# EasyEDA Pro project ProDoc_Eprobe_V3_1.epro, schematic 便携式电化学工作站V3_1

## Sheets
1 P1.MCU: Board Name: 便携式电化学工作站V3_1; Create Date: 2024-09-22; Page Name: P1.MCU; Project Name: 便携电化学工作站; Schematic Name: 便携式电化学工作站V3_1; Update Date: 2024-09-23; Company: 嘉立创EDA; Page Size: A4; Version: V1.0
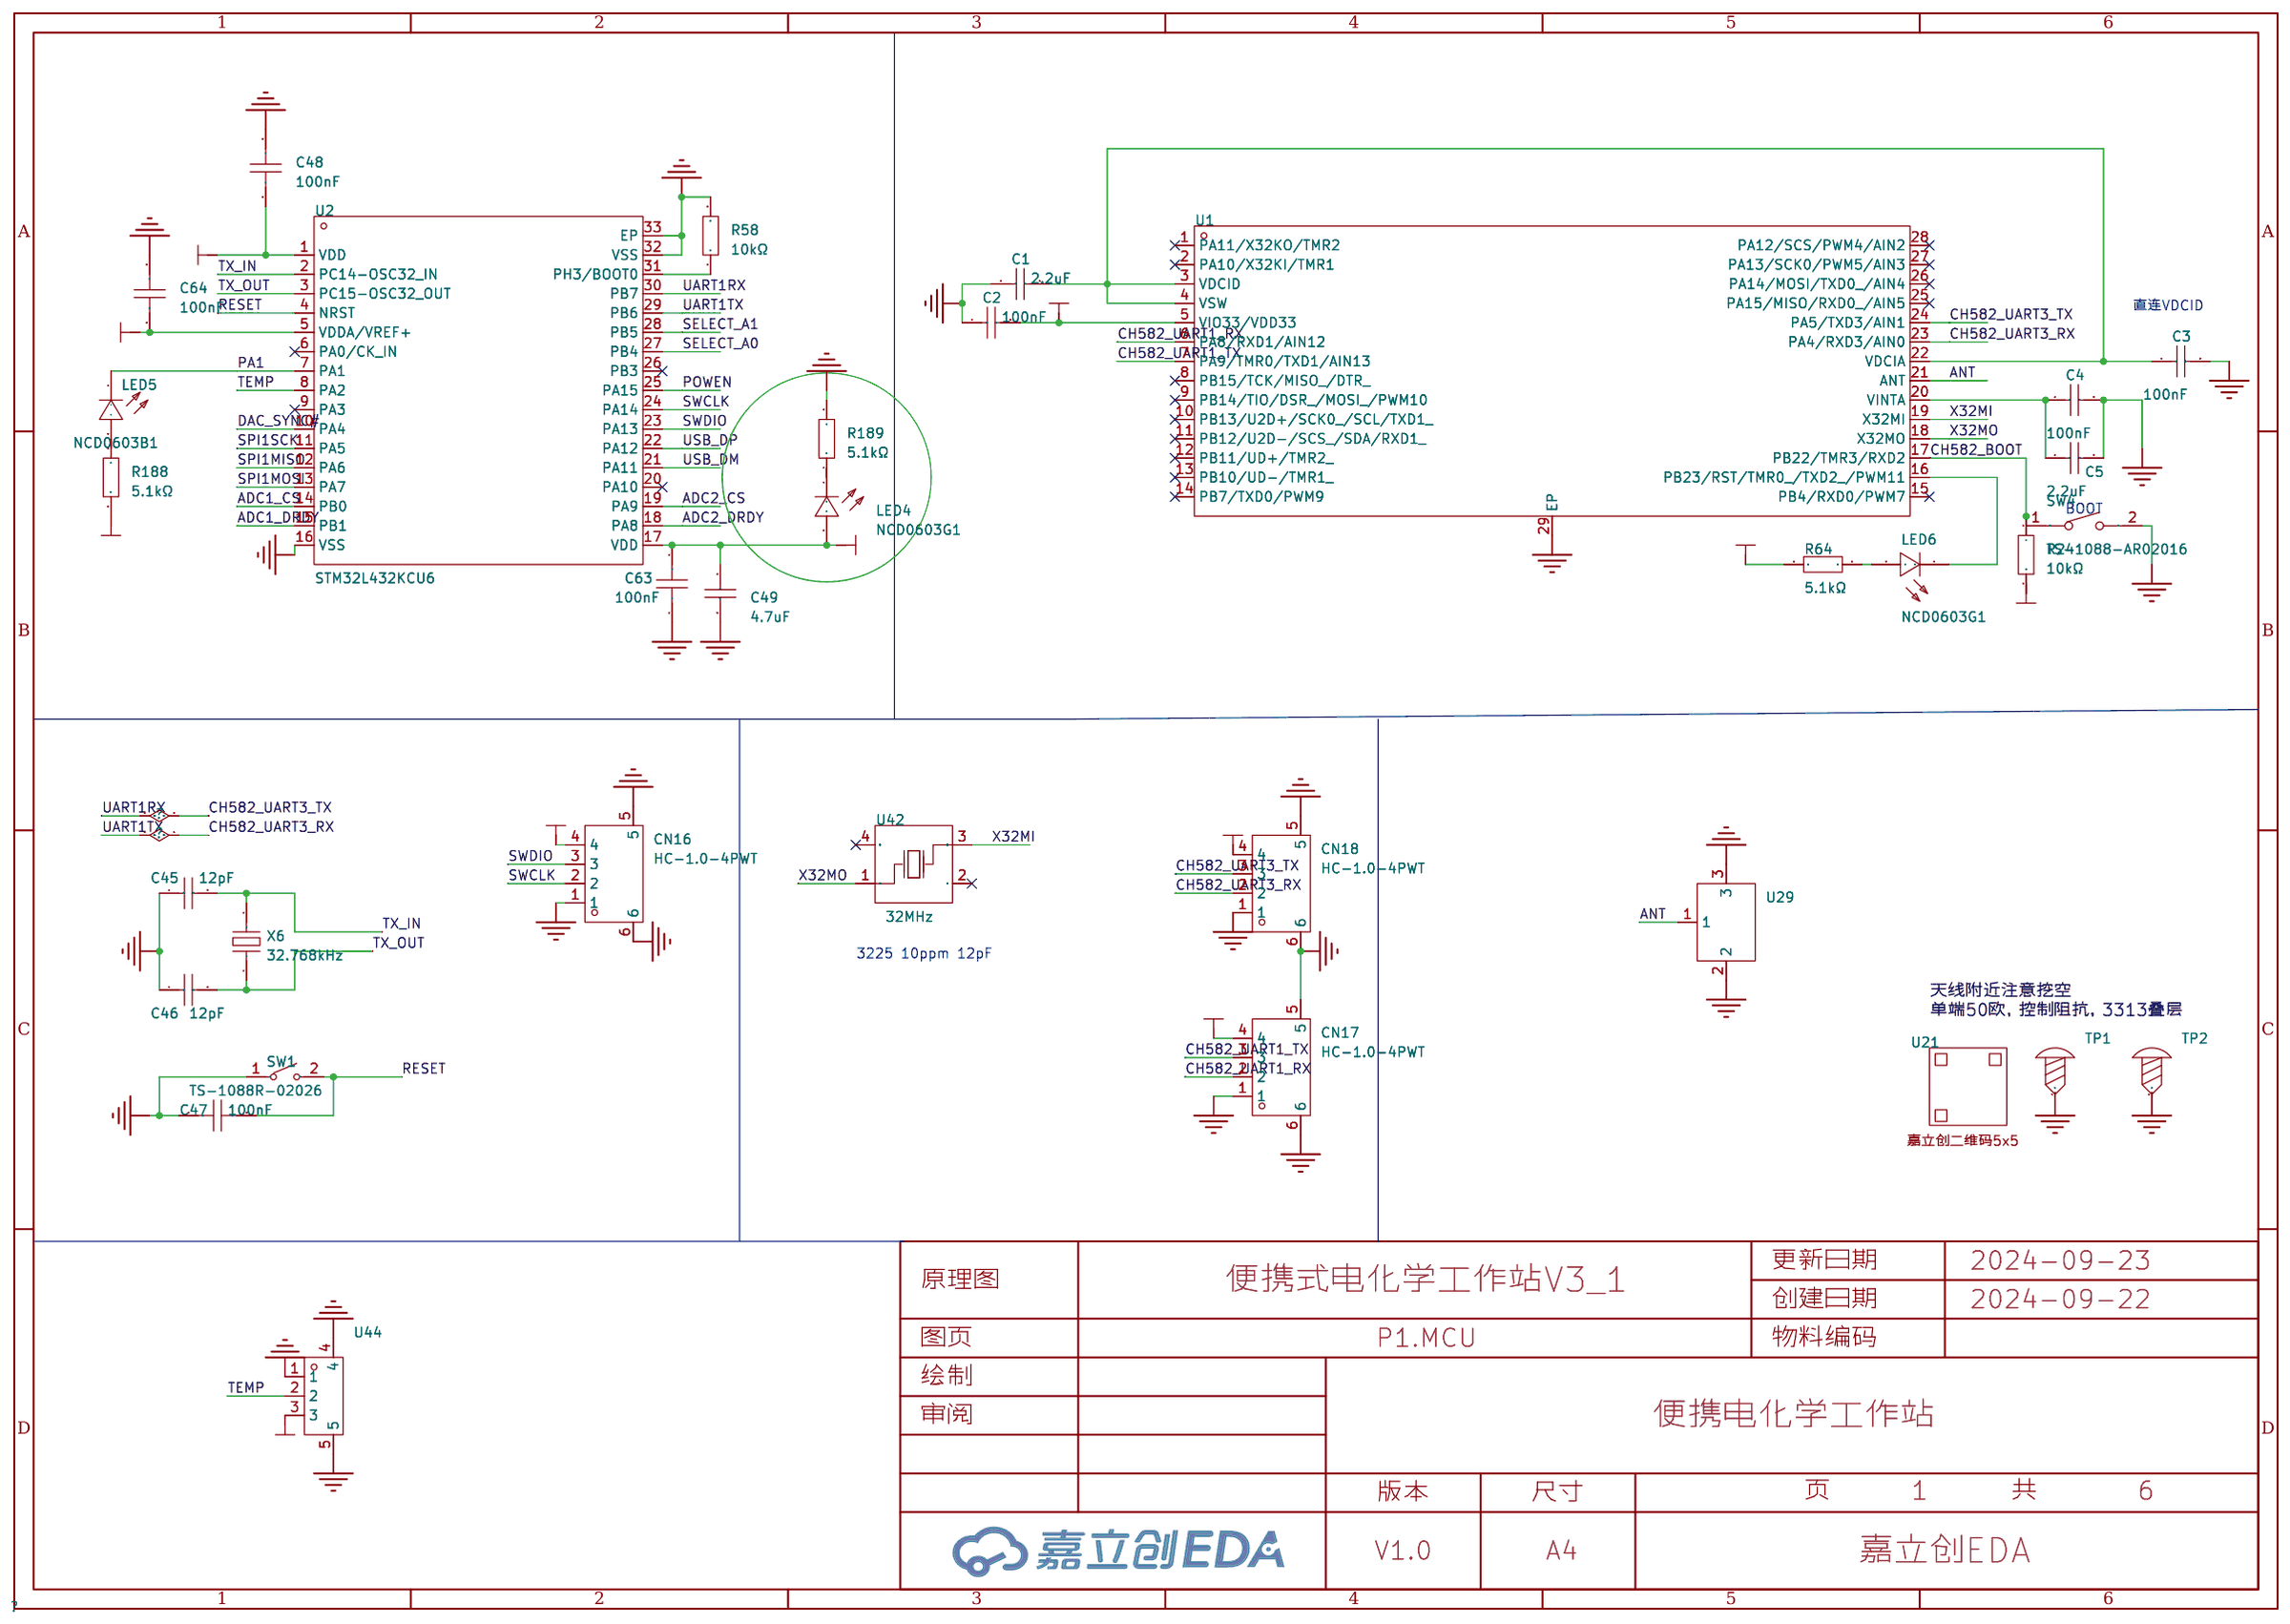
[diagram p0: P1.MCU]
2 P2.Power: Page Name: P2.Power; Update Date: 2024-10-11
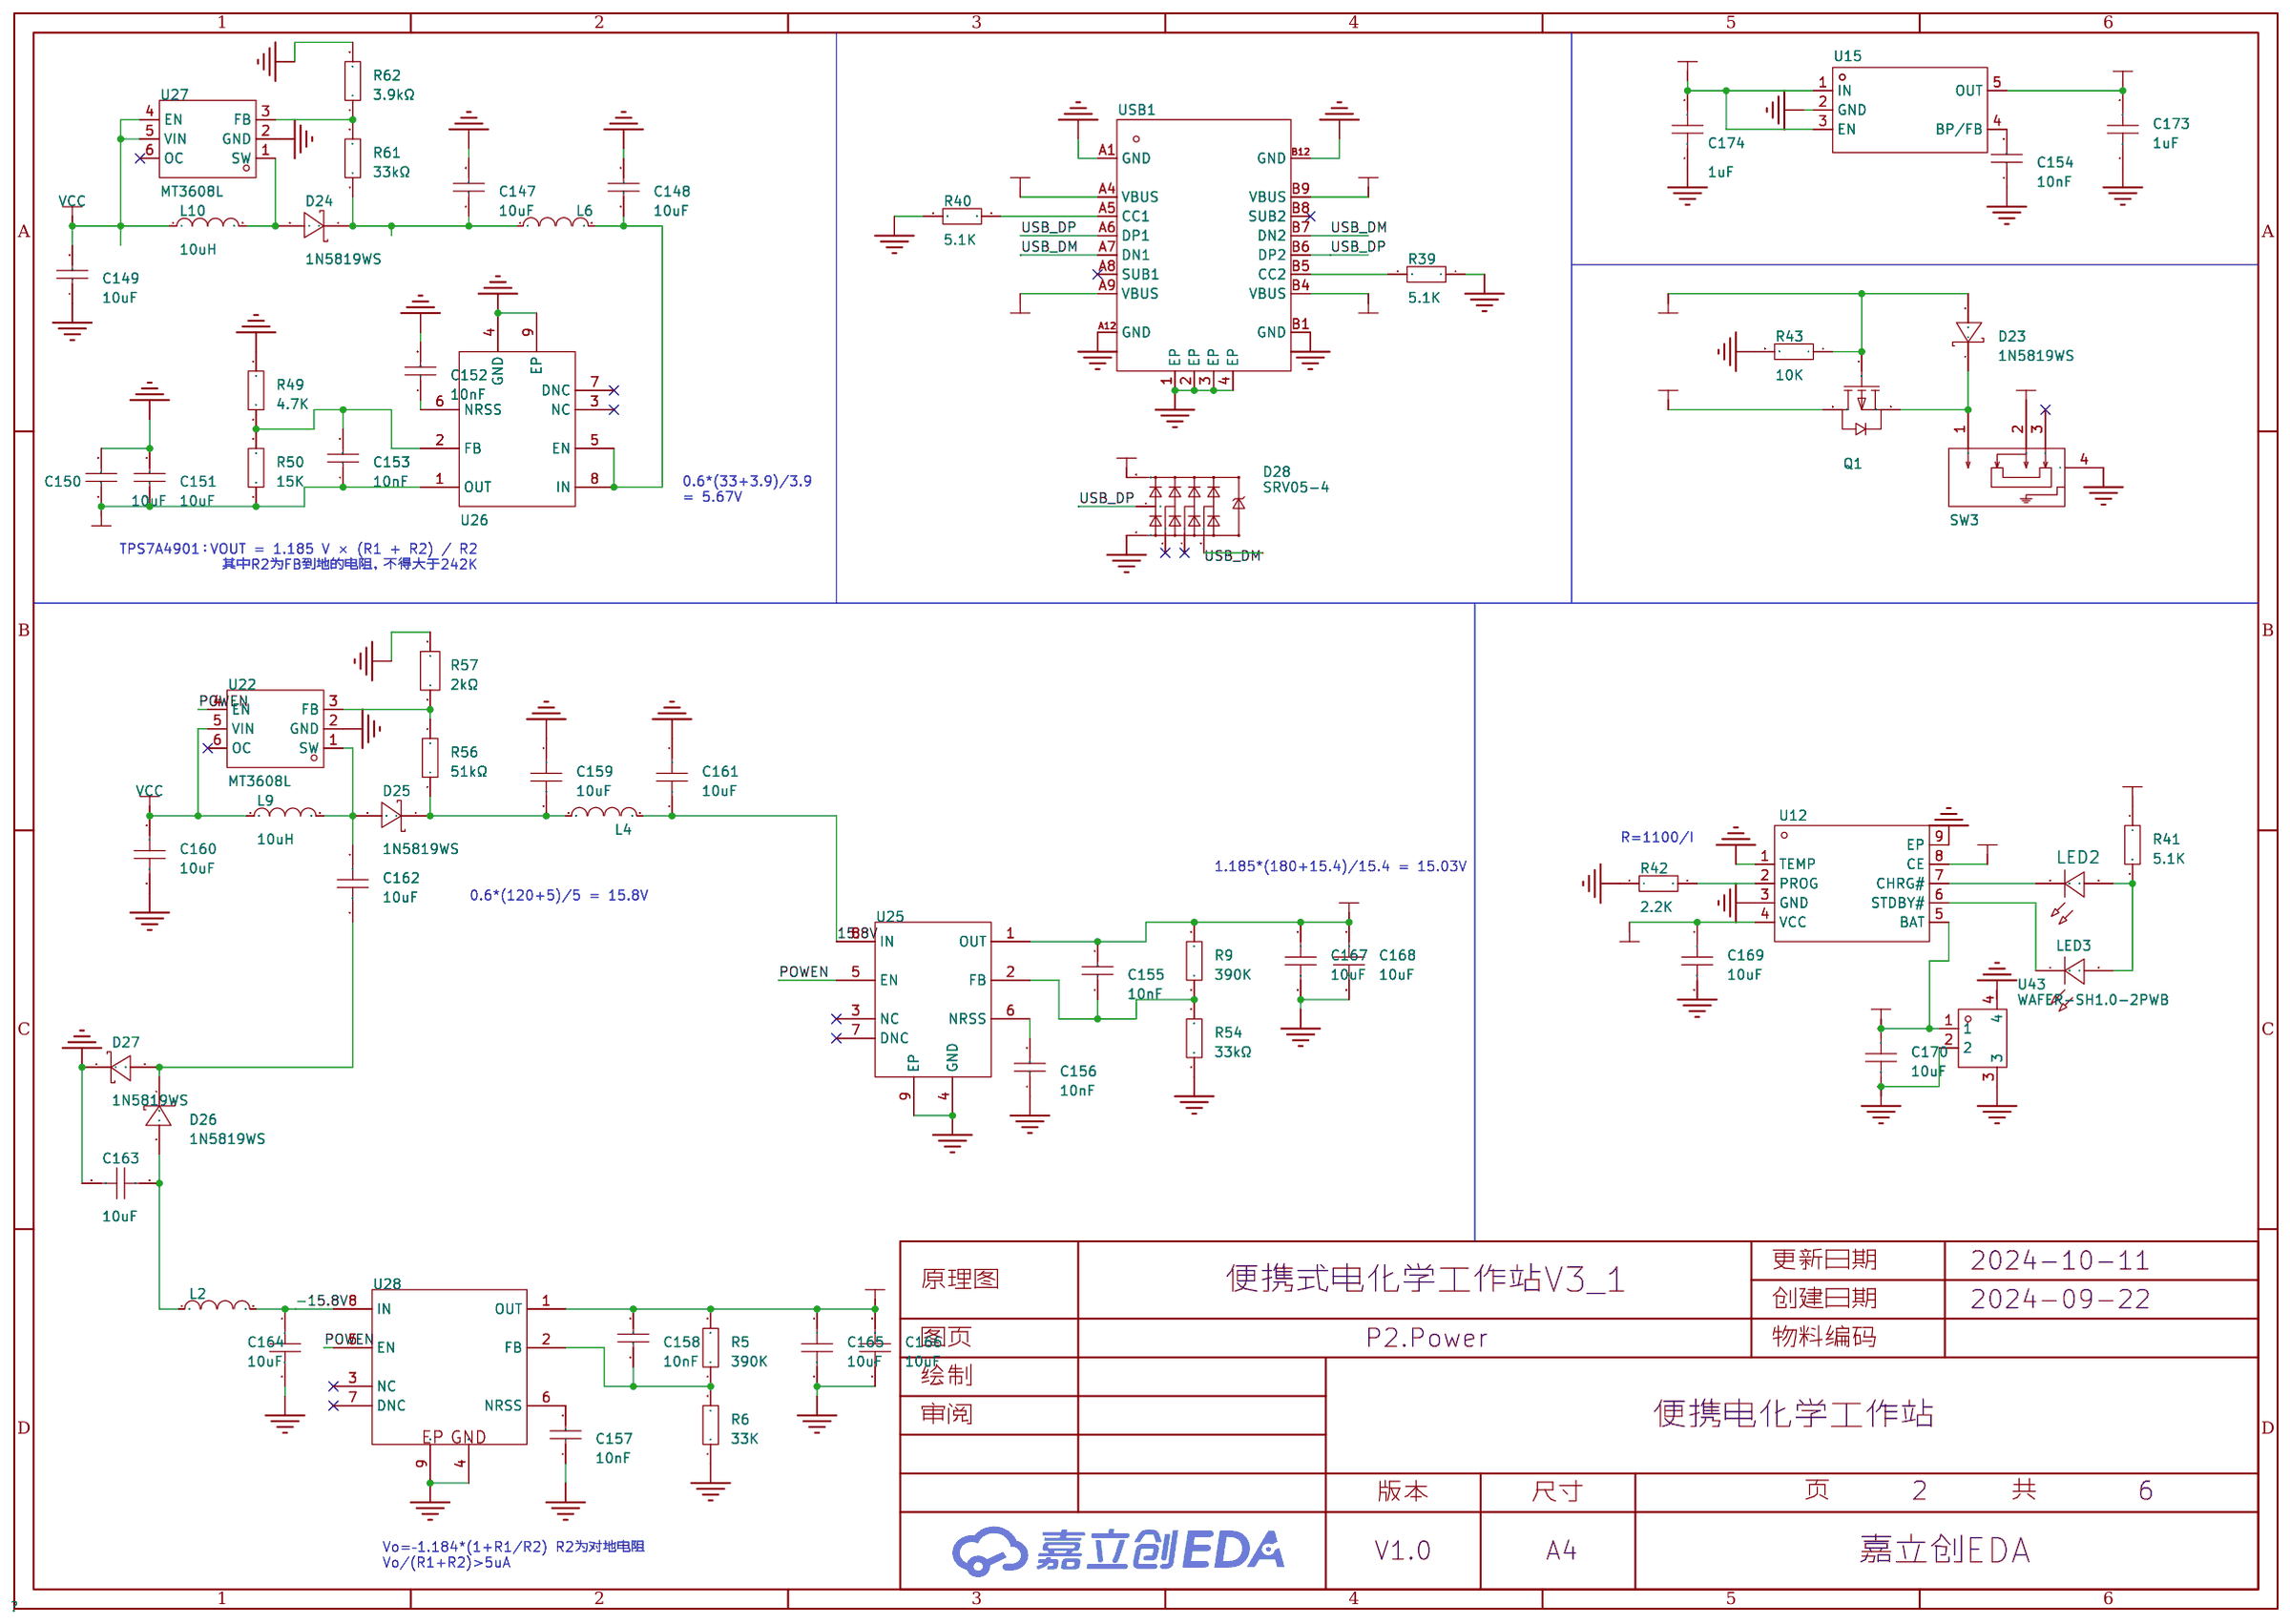
[diagram p1: P2.Power]
3 P3.ADDA: Page Name: P3.ADDA; Update Date: 2024-10-11
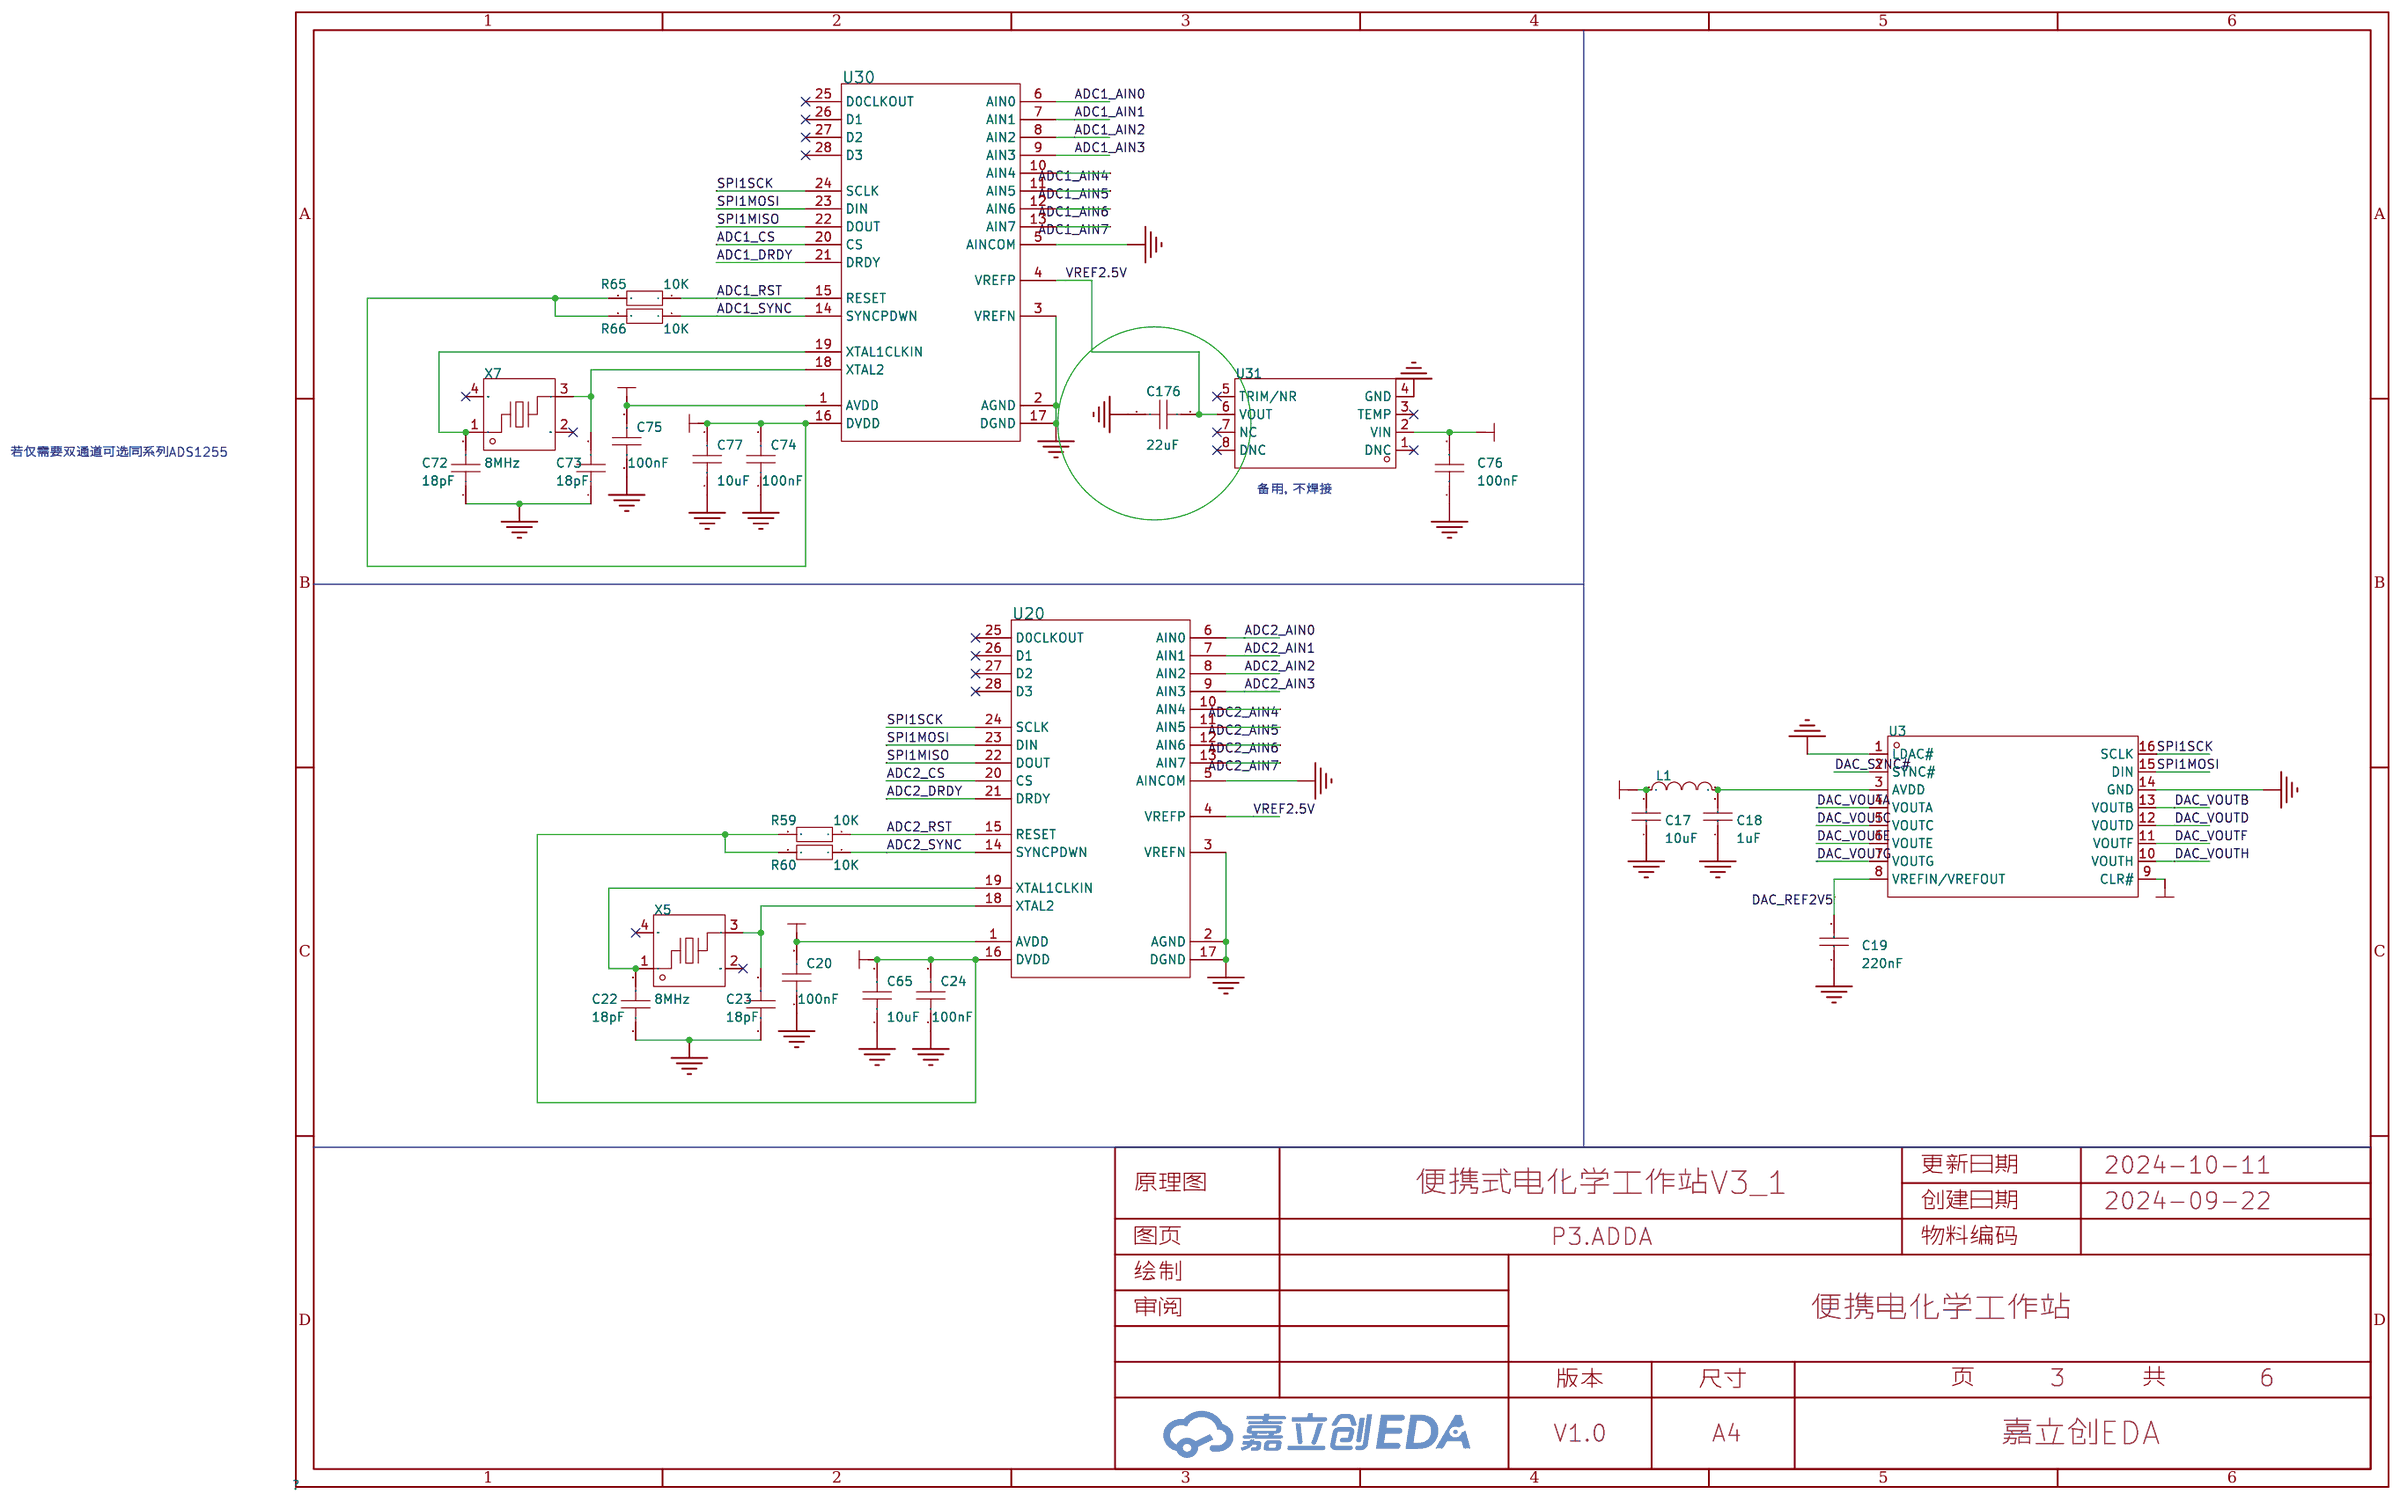
[diagram p2: P3.ADDA]
4 P4.TIA_1: Page Name: P4.TIA_1; Update Date: 2024-10-11
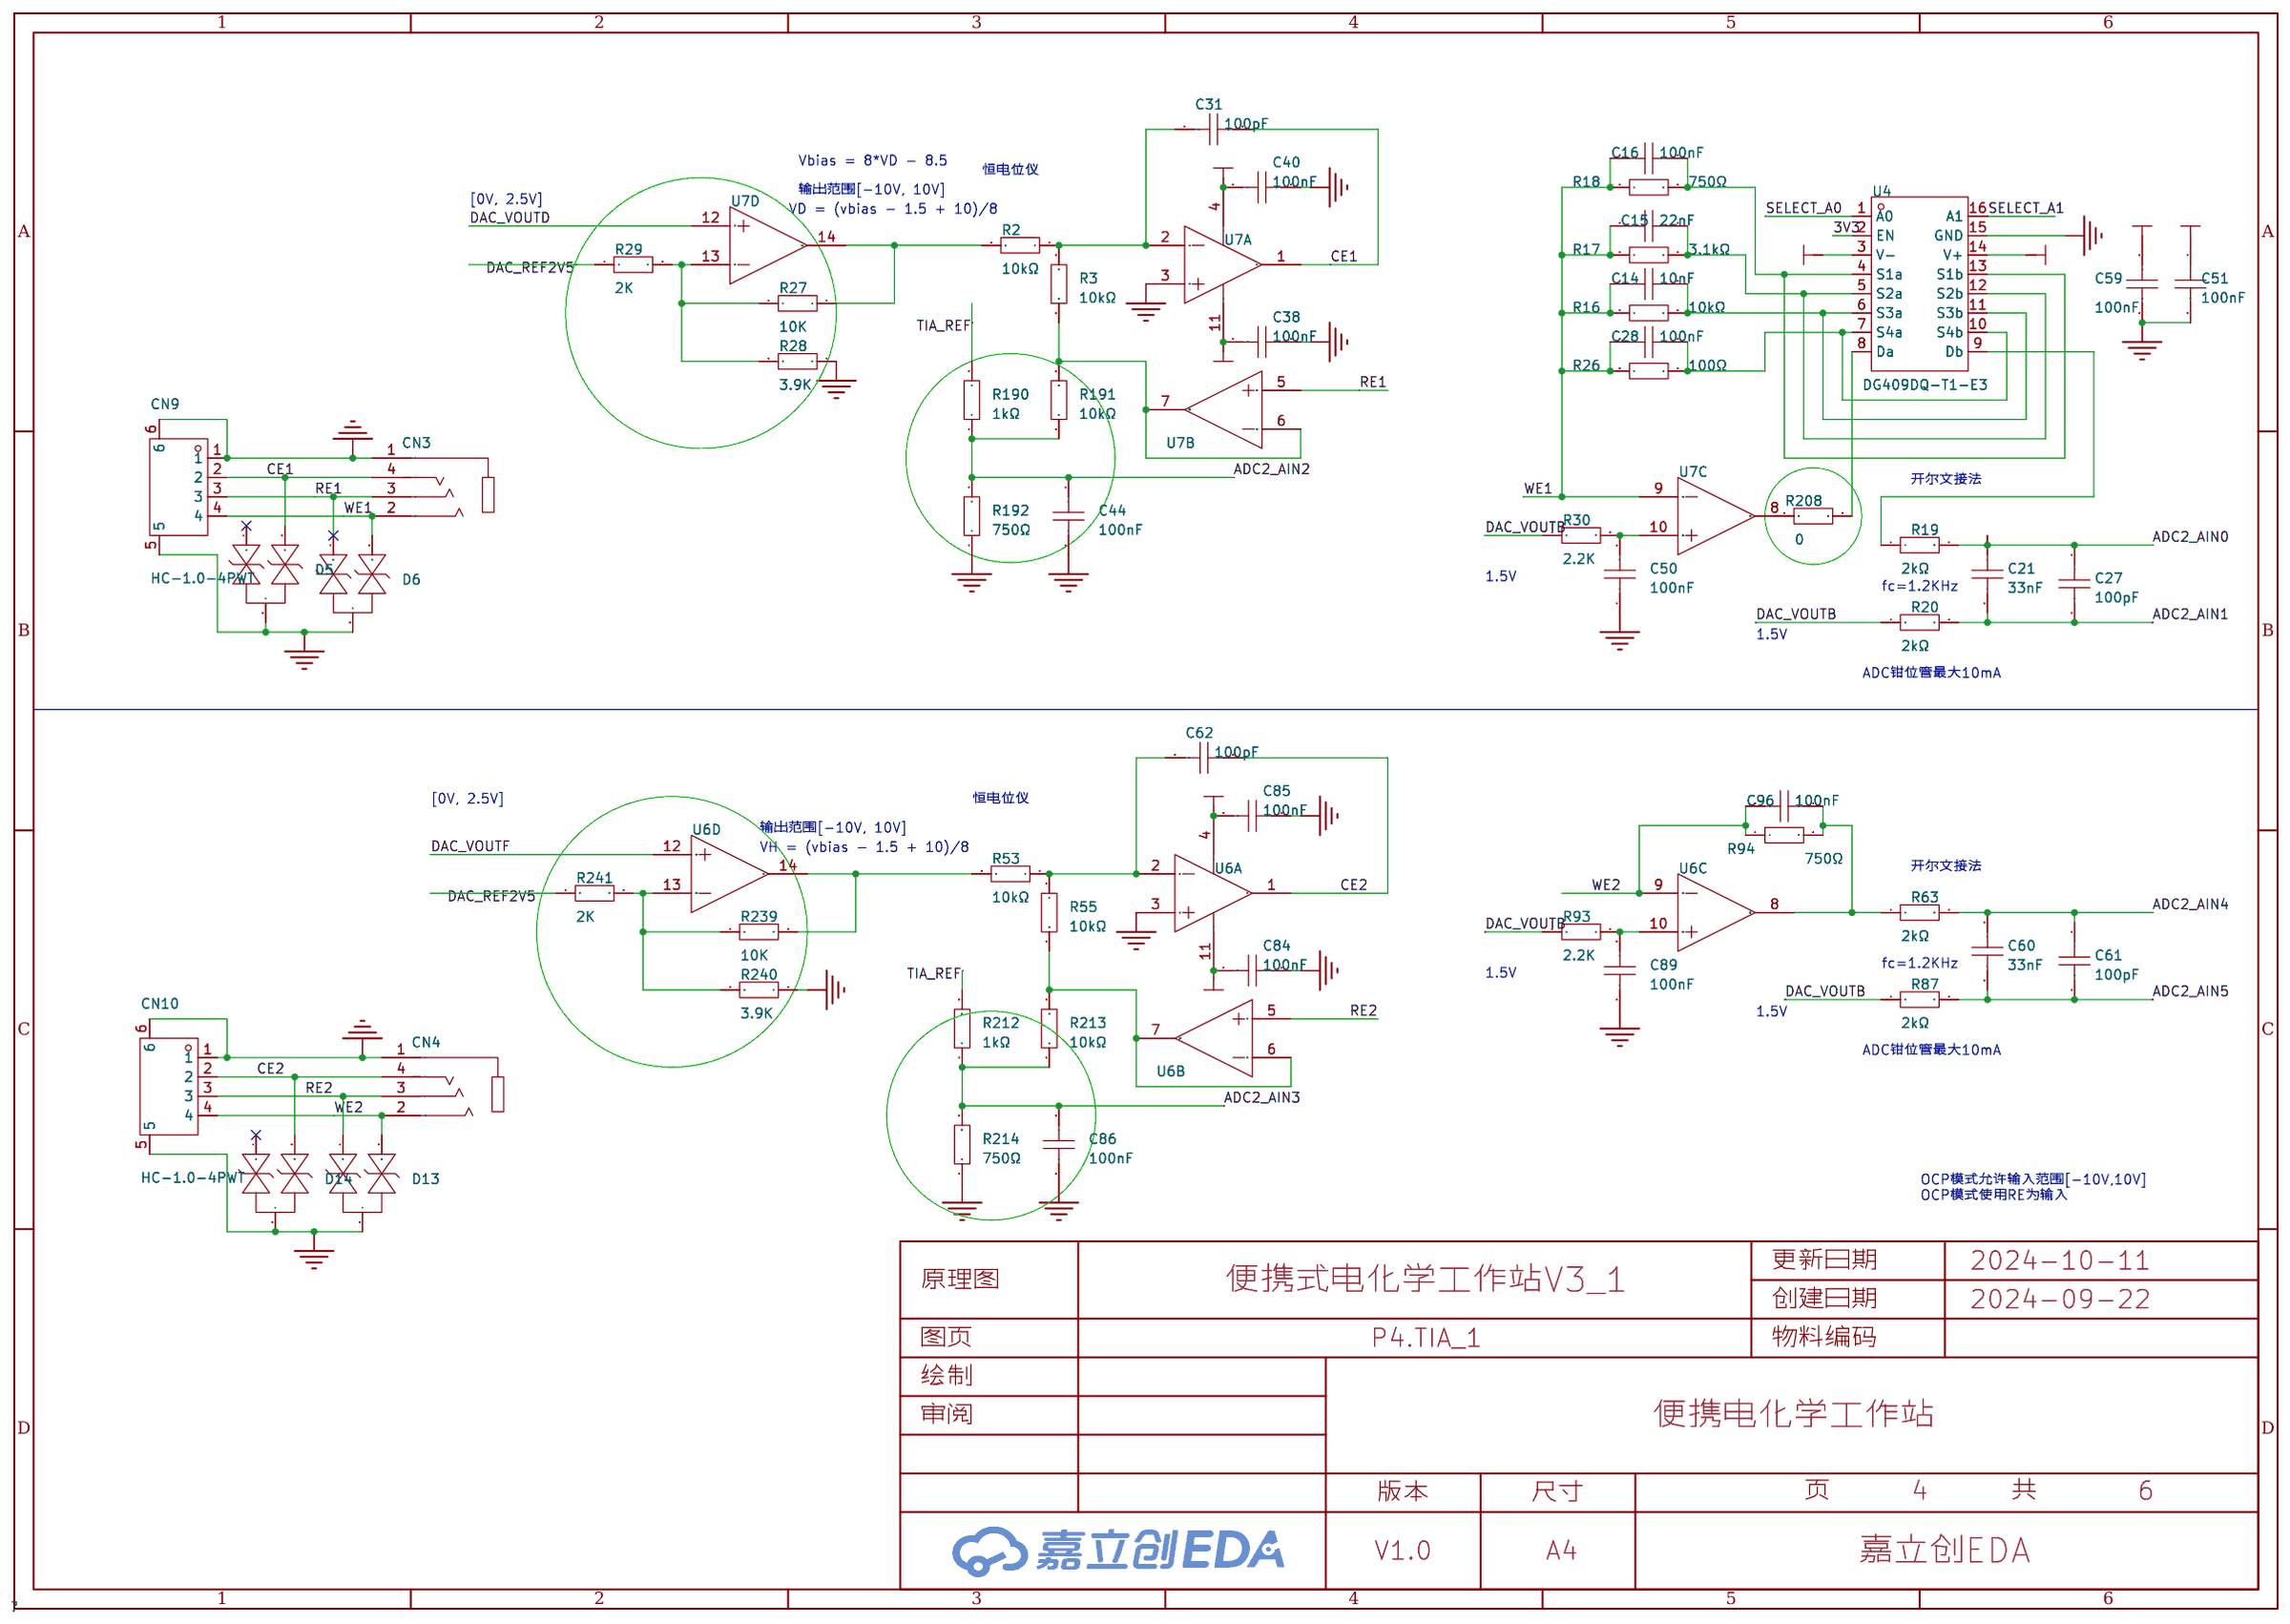
[diagram p3: P4.TIA_1]
5 P4.TIA_2: Page Name: P4.TIA_2; Update Date: 2024-10-11
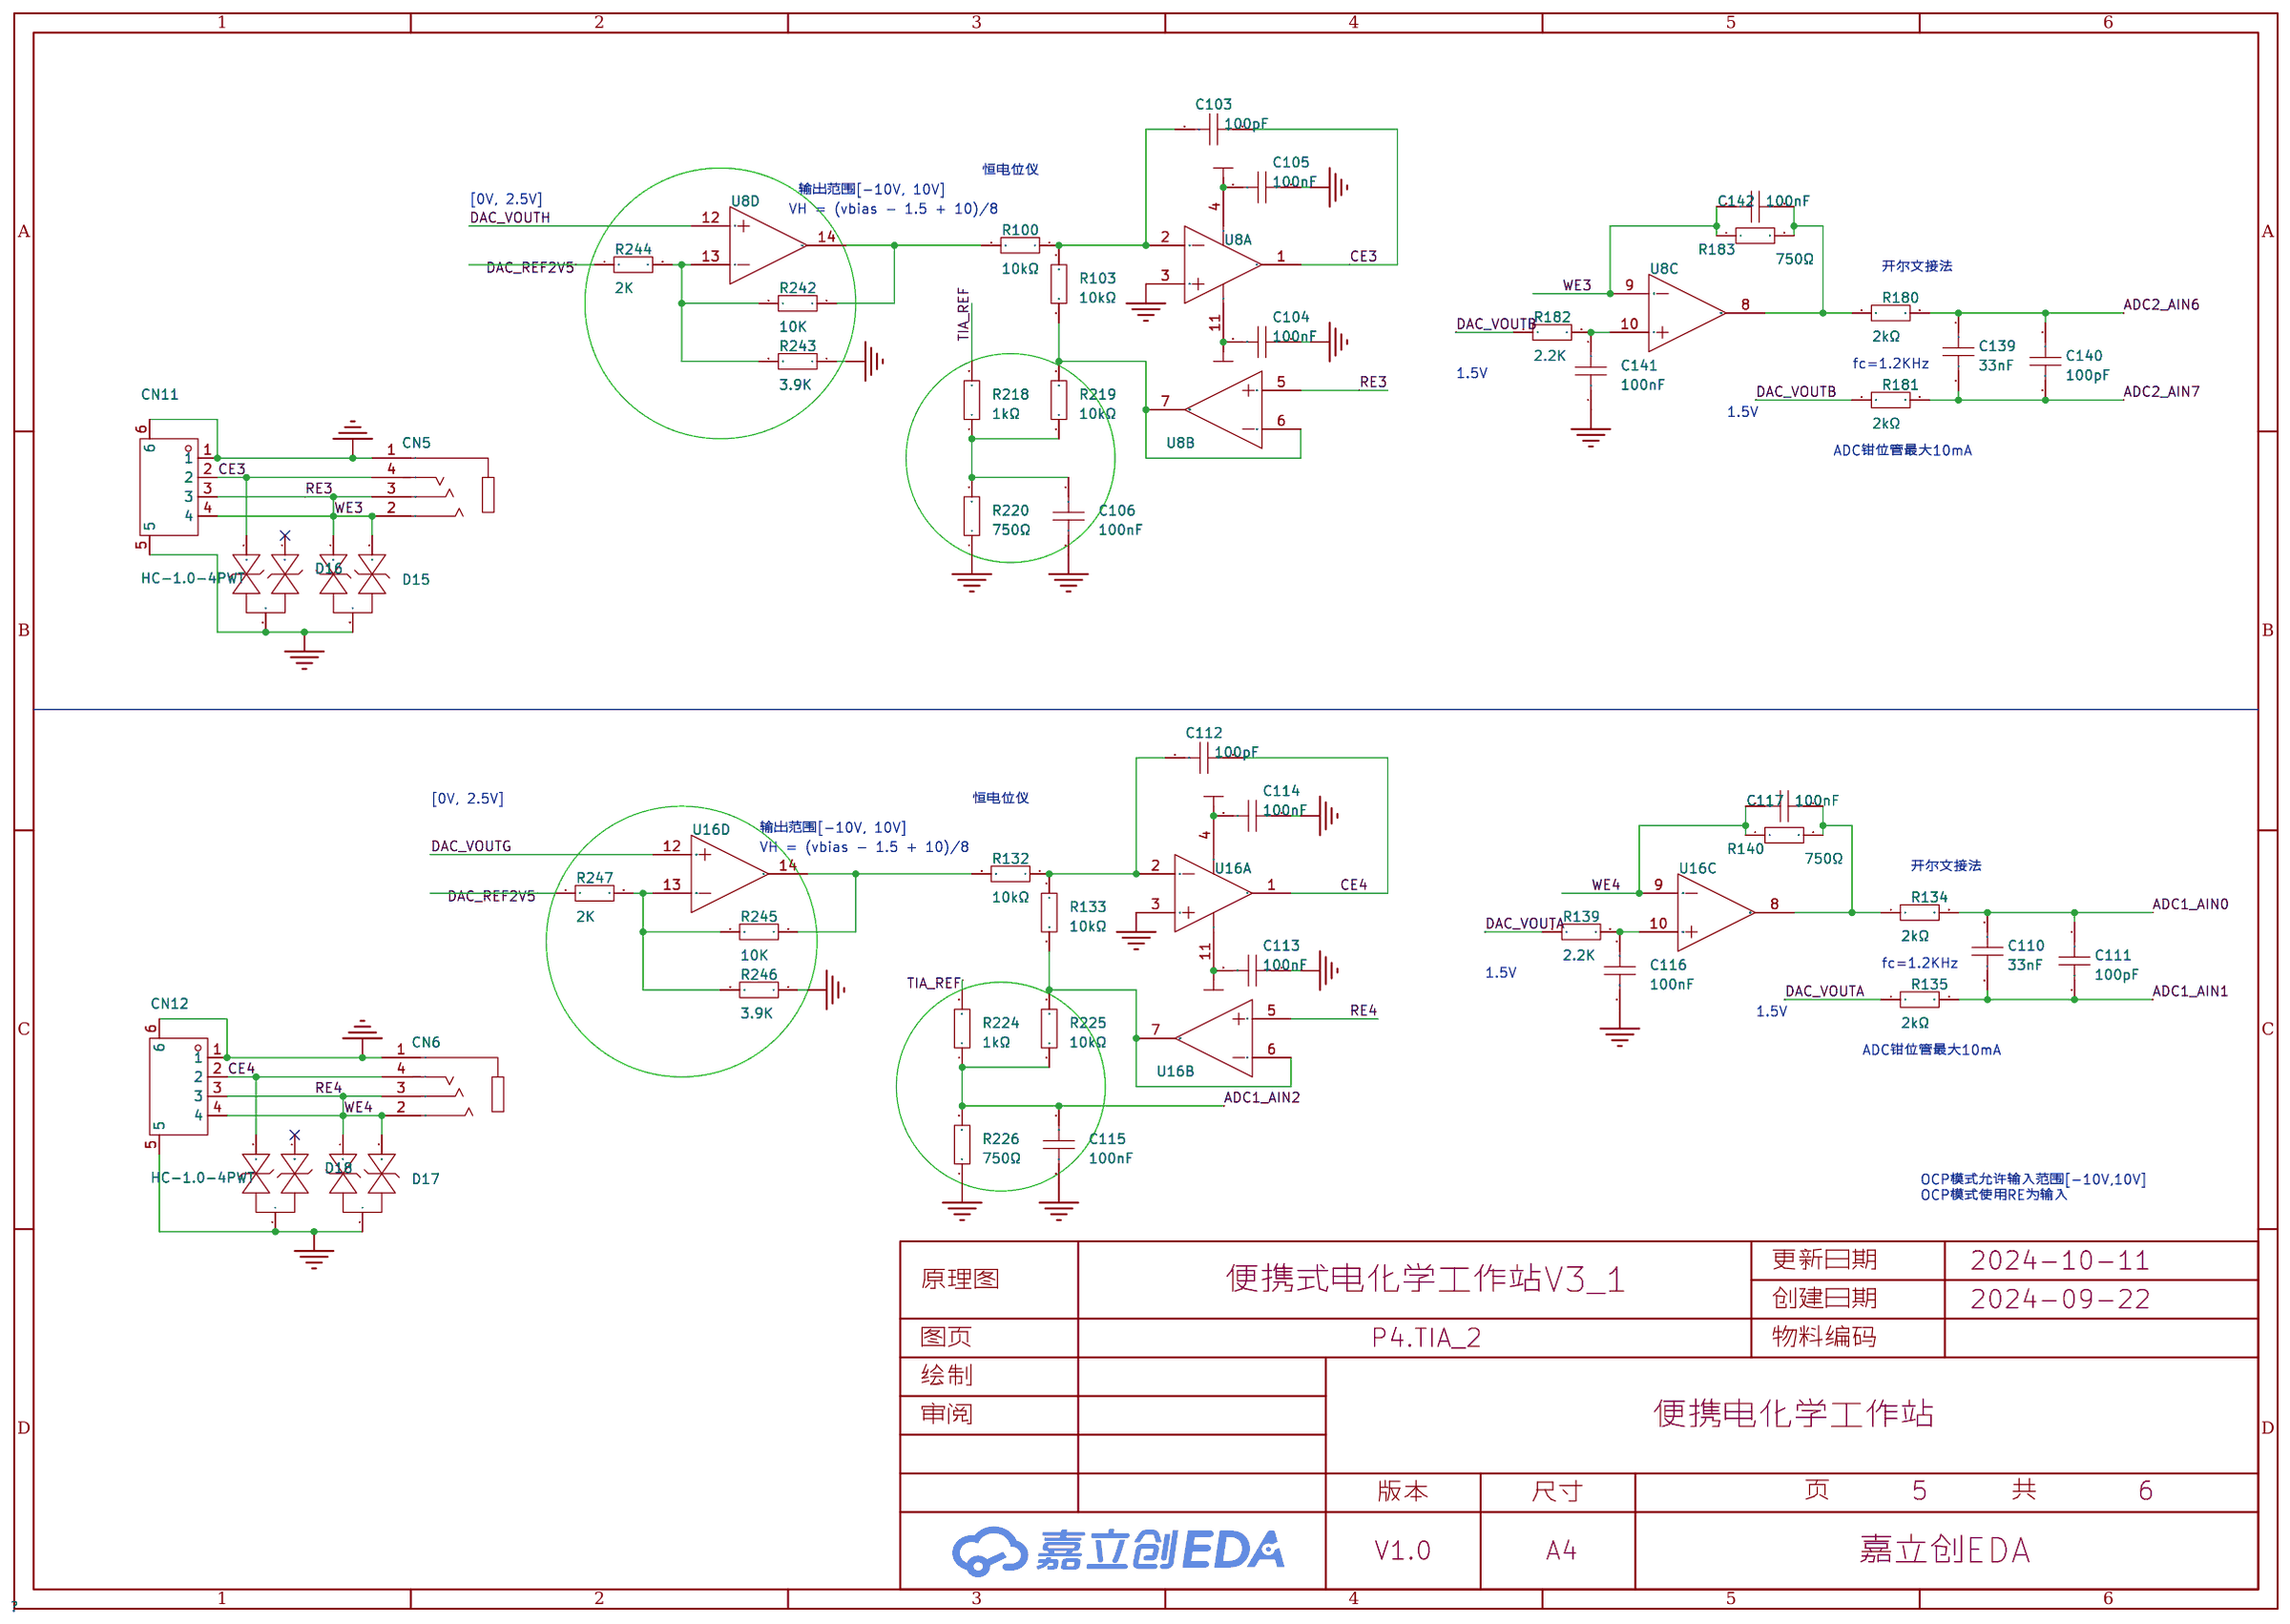
[diagram p4: P4.TIA_2]
6 P4.TIA_3: Page Name: P4.TIA_3; Update Date: 2024-10-11
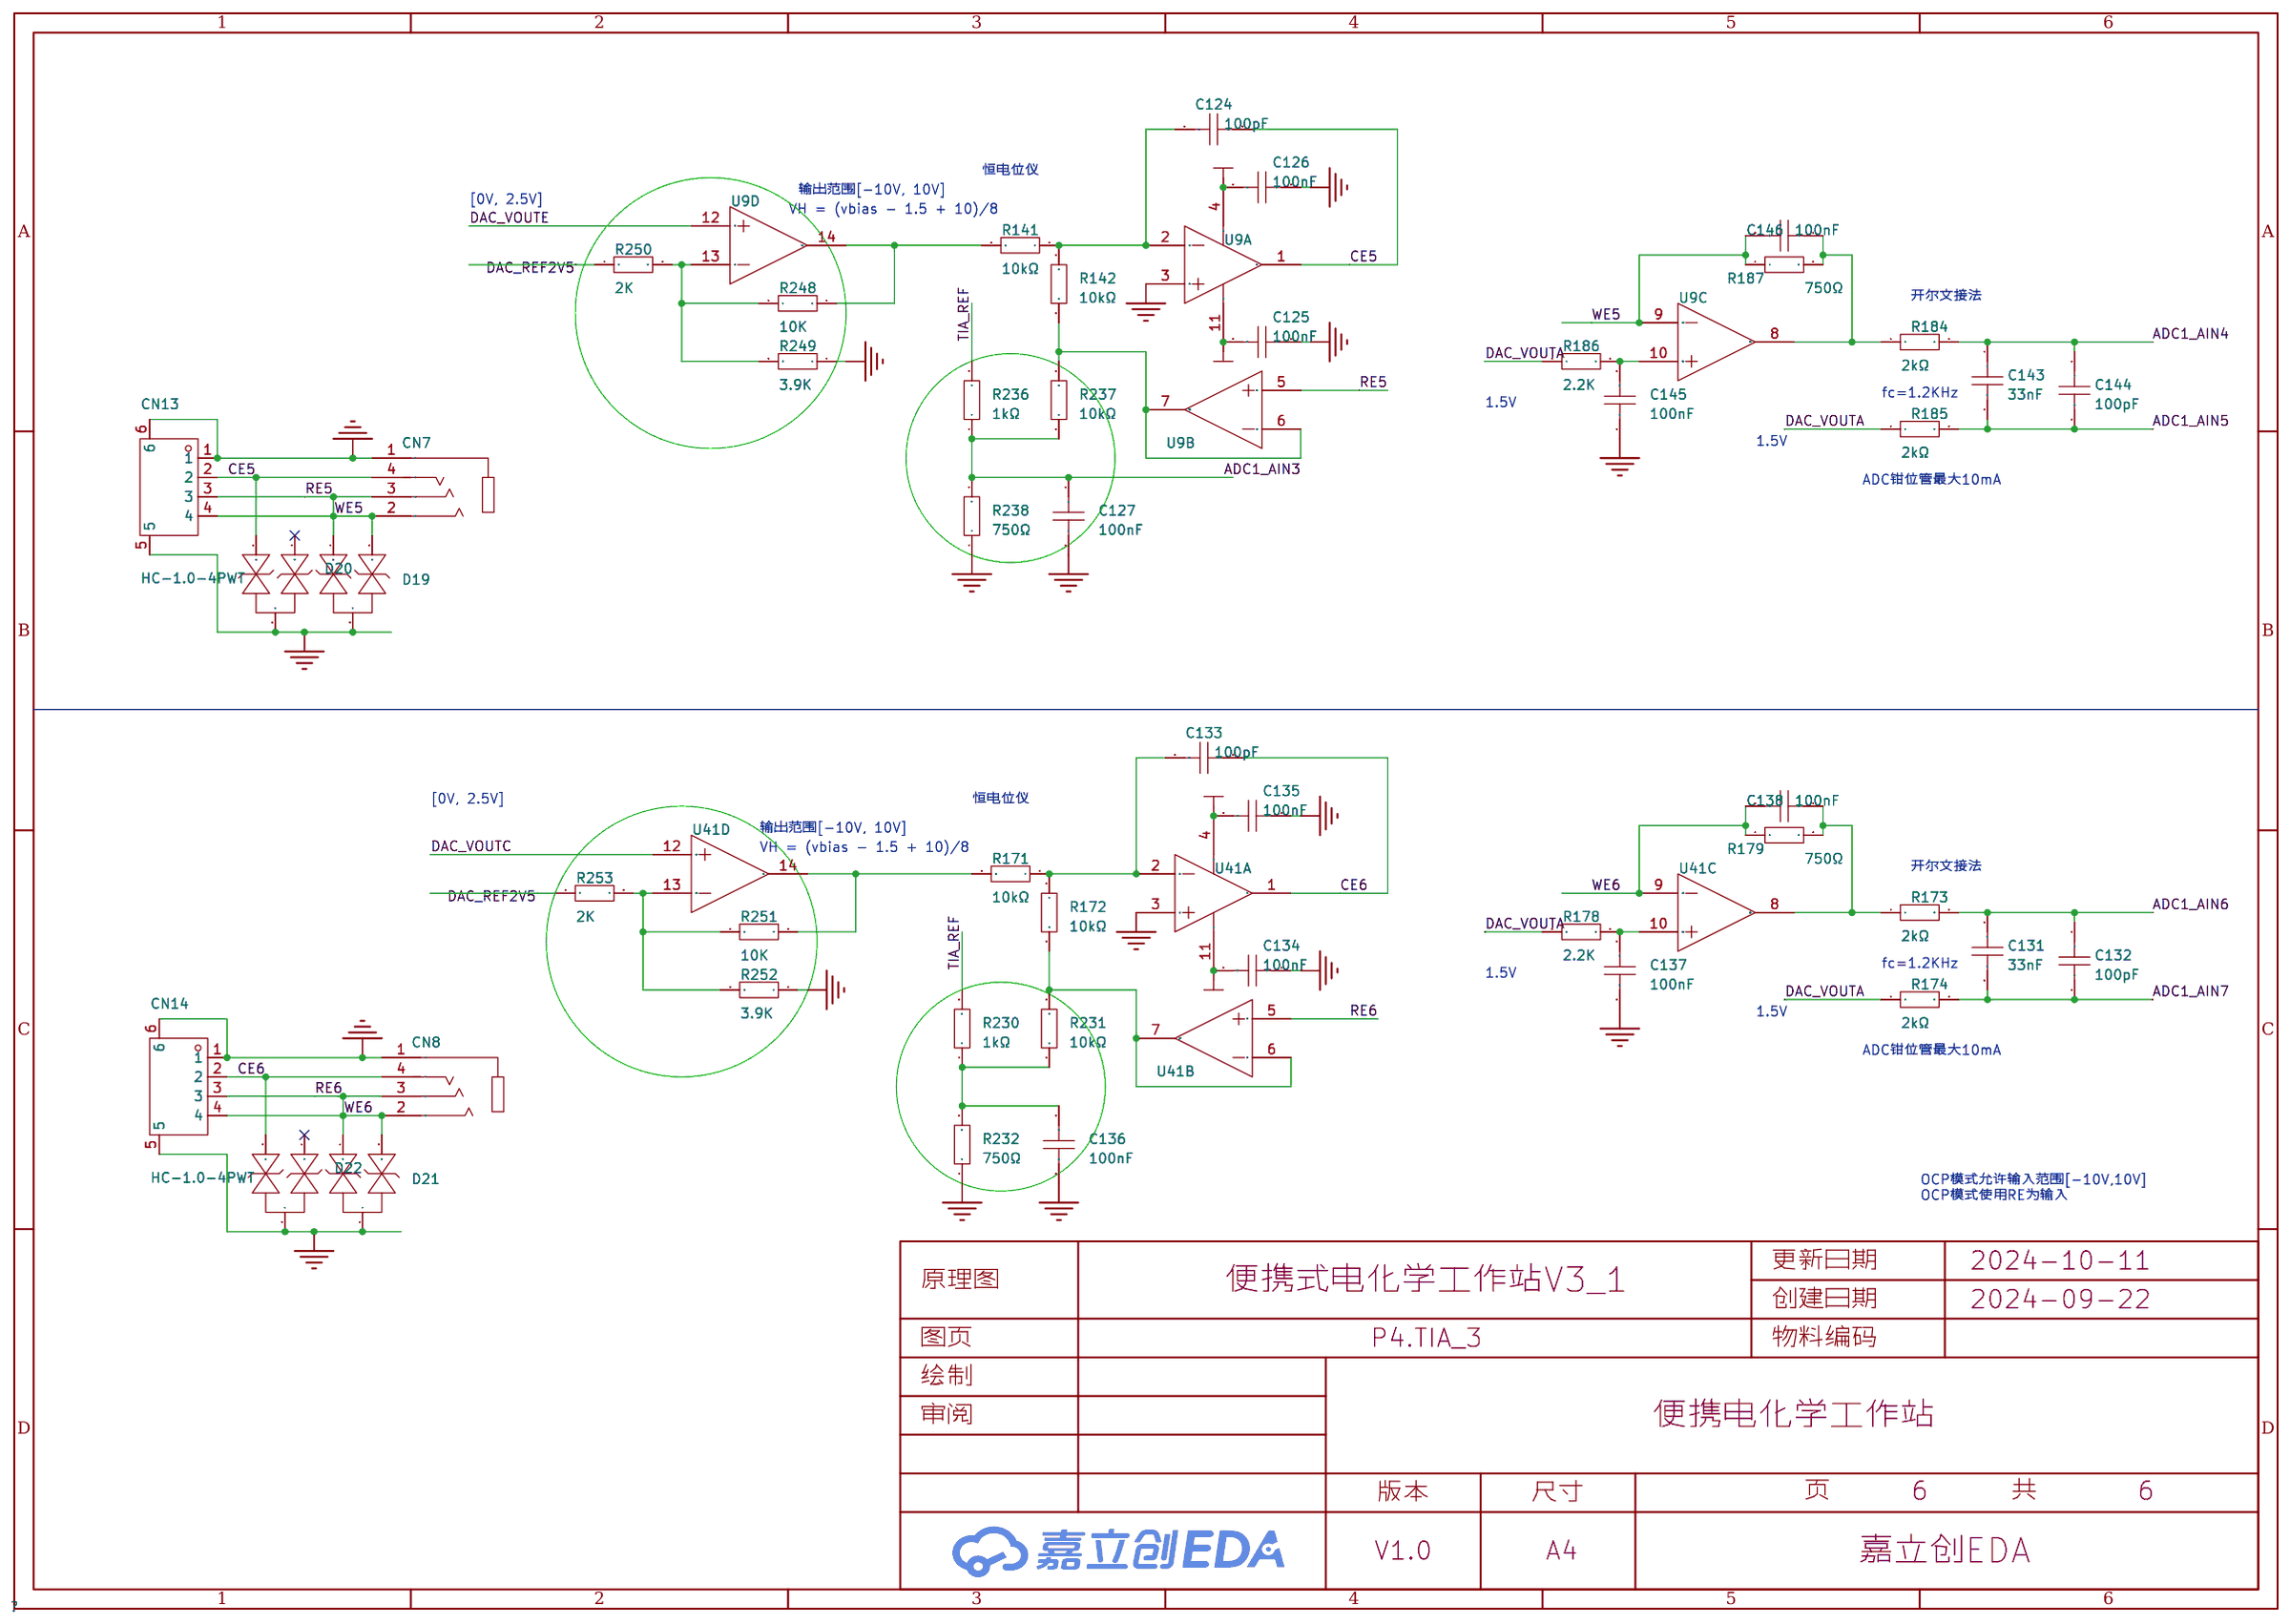
[diagram p5: P4.TIA_3]

## Parts
sheet P1.MCU
C1  2.2uF  [C0402]
C2  100nF  [C0402]
C3  100nF  [C0402]
C4  100nF  [C0402]
C5  2.2uF  [C0402]
C45  12pF  [C0402]
C46  12pF  [C0402]
C47  100nF  [C0402]
C48  100nF  [C0402]
C49  4.7uF  [C0402]
C63  100nF  [C0402]
C64  100nF  [C0402]
CN16  HC-1.0-4PWT  [CONN-SMD_4P-P1.00_HCTL_HC-1.0-4PWT]
CN17  HC-1.0-4PWT  [CONN-SMD_4P-P1.00_HCTL_HC-1.0-4PWT]
CN18  HC-1.0-4PWT  [CONN-SMD_4P-P1.00_HCTL_HC-1.0-4PWT]
LED4  NCD0603G1  [LED0603-RD]
LED5  NCD0603B1  [LED0603-RD]
LED6  NCD0603G1  [LED0603-RD]
R24  10kΩ  [R0402]
R58  10kΩ  [R0402]
R64  5.1kΩ  [R0402]
R188  5.1kΩ  [R0402]
R189  5.1kΩ  [R0402]
SW1  TS-1088R-02026  [SW-SMD_L3.9-W3.0-P4.45]
SW4  TS-1088-AR02016  [SW-SMD_L3.9-W3.0-P4.45]
TP1  -  [M2螺丝]
TP2  -  [M2螺丝]
U1  CH582F  [QFN-28_L4.0-W4.0-P0.40-BL-EP2.8]
U2  STM32L432KCU6  [UFQFPN-32_L5.0-W5.0-P0.50-TL-EP3.5]
U21  -  [JLC-QRCODE-5x5]
U29  BWU.FL-IPEX1  [IPEX-SMD_BWIPX-1-001E]
U42  32MHz  [CRYSTAL-SMD_4P-L2.0-W1.6-BL-2]
U44  WAFER-SH1.0-3PWB  [CONN-SMD_3P-P1.00_WAFER-SH1.0-3PWB]
X6  32.768kHz  [OSC-SMD_L3.2-W1.5]
sheet P2.Power
C147  10uF  [C0402]
C148  10uF  [C0402]
C149  10uF  [C0402]
C150  10uF  [C0402]
C151  10uF  [C0402]
C152  10nF  [C0402]
C153  10nF  [C0402]
C154  10nF  [C0402]
C155  10nF  [C0402]
C156  10nF  [C0402]
C157  10nF  [C0402]
C158  10nF  [C0402]
C159  10uF  [C0603]
C160  10uF  [C0603]
C161  10uF  [C0603]
C162  10uF  [C0603]
C163  10uF  [C0603]
C164  10uF  [C0603]
C165  10uF  [C0603]
C166  10uF  [C0603]
C167  10uF  [C0603]
C168  10uF  [C0603]
C169  10uF  [C0603]
C170  10uF  [C0603]
C173  1uF  [C0402]
C174  1uF  [C0402]
D23  1N5819WS  [SOD-323_L1.8-W1.3-LS2.5-RD]
D24  1N5819WS  [SOD-323_L1.8-W1.3-LS2.5-RD]
D25  1N5819WS  [SOD-323_L1.8-W1.3-LS2.5-RD]
D26  1N5819WS  [SOD-323_L1.8-W1.3-LS2.5-RD]
D27  1N5819WS  [SOD-323_L1.8-W1.3-LS2.5-RD]
D28  SRV05-4  [SOT-23-6_L2.9-W1.6-P0.95-LS2.8-BL-1]
L2  BLM18AG601SN1D  [L0603]
L4  BLM18AG601SN1D  [L0603]
L6  BLM18AG601SN1D  [L0603]
L9  10uH  [IND-SMD_L4.4-W4.2_BCIHP0412SC]
L10  10uH  [IND-SMD_L4.4-W4.2_BCIHP0412SC]
LED2  -  [LED_0603]
LED3  -  [LED_0603]
Q1  AO3401A  [SOT-23_L2.9-W1.3-P1.90-LS2.4-BR]
R5  390K  [R0402]
R6  33K  [R0402]
R9  390K  [R0402]
R39  5.1K  [R0402]
R40  5.1K  [R0402]
R41  5.1K  [R0402]
R42  2.2K  [R0402]
R43  10K  [R0402]
R49  4.7K  [R0402]
R50  15K  [R0402]
R54  33kΩ  [R0402]
R56  51kΩ  [R0402]
R57  2kΩ  [R0402]
R61  33kΩ  [R0402]
R62  3.9kΩ  [R0402]
SW3  MSK12C02  [SW-TH_MSK12C02]
U12  TP4056  [ESOP-8_L4.9-W3.9-P1.27-LS6.0-BL-EP]
U15  SGM2036-3.3YN5G/TR  [SOT-23-5_L3.0-W1.7-P0.95-LS2.8-BR]
U22  MT3608L  [SOT-23-6_L2.9-W1.7-P0.95-LS2.8-BL]
U25  TPS7A4901DGNT  [MSOP-8_L3.0-W3.0-P0.65-LS4.9-BL-EP1.8]
U26  TPS7A4901DGNT  [MSOP-8_L3.0-W3.0-P0.65-LS4.9-BL-EP1.8]
U27  MT3608L  [SOT-23-6_L2.9-W1.7-P0.95-LS2.8-BL]
U28  TPS7A3001DGNR  [MSOP-8_L3.0-W3.0-P0.65-LS5.0-BL-EP]
U43  WAFER-SH1.0-2PWB  [CONN-SMD_2P-P1.00_XUNPU_WAFER-SH1.0-2PWB]
USB1  KH-TYPE-C-16P  [USB-C-SMD_KH-TYPE-C-16P]
sheet P3.ADDA
C17  10uF  [C0402]
C18  1uF  [C0402]
C19  220nF  [C0402]
C20  100nF  [C0402]
C22  18pF  [C0402]
C23  18pF  [C0402]
C24  100nF  [C0402]
C65  10uF  [C0402]
C72  18pF  [C0402]
C73  18pF  [C0402]
C74  100nF  [C0402]
C75  100nF  [C0402]
C76  100nF  [C0402]
C77  10uF  [C0402]
C176  22uF  [C0402]
L1  BLM18AG601SN1D  [L0603]
R59  10K  [R0402]
R60  10K  [R0402]
R65  10K  [R0402]
R66  10K  [R0402]
U3  DAC8568ICPWR  [TSSOP-16_L5.0-W4.4-P0.65-LS6.4-BL]
U20  ADS1256IDBR  [SSOP-28_L10.2-W5.3-P0.65-LS7.8-BL]
U30  ADS1256IDBR  [SSOP-28_L10.2-W5.3-P0.65-LS7.8-BL]
U31  REF5025AIDR  [SOIC-8_L4.9-W3.9-P1.27-LS6.0-BL]
X5  8MHz  [OSC-SMD_4P-L3.2-W2.5-BL]
X7  8MHz  [OSC-SMD_4P-L3.2-W2.5-BL]
sheet P4.TIA_1
C14  10nF  [C0402]
C15  22nF  [C0402]
C16  100nF  [C0402]
C21  33nF  [C0402]
C27  100pF  [C0402]
C28  100nF  [C0402]
C31  100pF  [C0402]
C38  100nF  [C0402]
C40  100nF  [C0402]
C44  100nF  [C0402]
C50  100nF  [C0402]
C51  100nF  [C0402]
C59  100nF  [C0402]
C60  33nF  [C0402]
C61  100pF  [C0402]
C62  100pF  [C0402]
C84  100nF  [C0402]
C85  100nF  [C0402]
C86  100nF  [C0402]
C89  100nF  [C0402]
C96  100nF  [C0402]
CN3  PJ-320D  [AUDIO-SMD_PJ-320D]
CN4  PJ-320D  [AUDIO-SMD_PJ-320D]
CN9  HC-1.0-4PWT  [CONN-SMD_4P-P1.00_HCTL_HC-1.0-4PWT]
CN10  HC-1.0-4PWT  [CONN-SMD_4P-P1.00_HCTL_HC-1.0-4PWT]
D5  NUP2105LT1G  [SOT-23-3_L2.9-W1.3-P1.90-LS2.4-BR]
D6  NUP2105LT1G  [SOT-23-3_L2.9-W1.3-P1.90-LS2.4-BR]
D13  NUP2105LT1G  [SOT-23-3_L2.9-W1.3-P1.90-LS2.4-BR]
D14  NUP2105LT1G  [SOT-23-3_L2.9-W1.3-P1.90-LS2.4-BR]
R2  10kΩ  [R0402]
R3  10kΩ  [R0402]
R16  10kΩ  [R0402]
R17  3.1kΩ  [R0402]
R18  750Ω  [R0402]
R19  2kΩ  [R0402]
R20  2kΩ  [R0402]
R26  100Ω  [R0402]
R27  10K  [R0402]
R28  3.9K  [R0402]
R29  2K  [R0402]
R30  2.2K  [R0402]
R53  10kΩ  [R0402]
R55  10kΩ  [R0402]
R63  2kΩ  [R0402]
R87  2kΩ  [R0402]
R93  2.2K  [R0402]
R94  750Ω  [R0402]
R190  1kΩ  [R0402]
R191  10kΩ  [R0402]
R192  750Ω  [R0402]
R208  0  [R0402]
R212  1kΩ  [R0402]
R213  10kΩ  [R0402]
R214  750Ω  [R0402]
R239  10K  [R0402]
R240  3.9K  [R0402]
R241  2K  [R0402]
U4  DG409DQ-T1-E3  [TSSOP-16_L5.0-W4.4-P0.65-LS6.4-BL]
U6  OPA4197QPWRQ1  [TSSOP-14_L5.0-W4.4-P0.65-LS6.4-BL]  (sections 1,2,3,4)
U7  OPA4197QPWRQ1  [TSSOP-14_L5.0-W4.4-P0.65-LS6.4-BL]  (sections 1,2,3,4)
sheet P4.TIA_2
C103  100pF  [C0402]
C104  100nF  [C0402]
C105  100nF  [C0402]
C106  100nF  [C0402]
C110  33nF  [C0402]
C111  100pF  [C0402]
C112  100pF  [C0402]
C113  100nF  [C0402]
C114  100nF  [C0402]
C115  100nF  [C0402]
C116  100nF  [C0402]
C117  100nF  [C0402]
C139  33nF  [C0402]
C140  100pF  [C0402]
C141  100nF  [C0402]
C142  100nF  [C0402]
CN5  PJ-320D  [AUDIO-SMD_PJ-320D]
CN6  PJ-320D  [AUDIO-SMD_PJ-320D]
CN11  HC-1.0-4PWT  [CONN-SMD_4P-P1.00_HCTL_HC-1.0-4PWT]
CN12  HC-1.0-4PWT  [CONN-SMD_4P-P1.00_HCTL_HC-1.0-4PWT]
D15  NUP2105LT1G  [SOT-23-3_L2.9-W1.3-P1.90-LS2.4-BR]
D16  NUP2105LT1G  [SOT-23-3_L2.9-W1.3-P1.90-LS2.4-BR]
D17  NUP2105LT1G  [SOT-23-3_L2.9-W1.3-P1.90-LS2.4-BR]
D18  NUP2105LT1G  [SOT-23-3_L2.9-W1.3-P1.90-LS2.4-BR]
R100  10kΩ  [R0402]
R103  10kΩ  [R0402]
R132  10kΩ  [R0402]
R133  10kΩ  [R0402]
R134  2kΩ  [R0402]
R135  2kΩ  [R0402]
R139  2.2K  [R0402]
R140  750Ω  [R0402]
R180  2kΩ  [R0402]
R181  2kΩ  [R0402]
R182  2.2K  [R0402]
R183  750Ω  [R0402]
R218  1kΩ  [R0402]
R219  10kΩ  [R0402]
R220  750Ω  [R0402]
R224  1kΩ  [R0402]
R225  10kΩ  [R0402]
R226  750Ω  [R0402]
R242  10K  [R0402]
R243  3.9K  [R0402]
R244  2K  [R0402]
R245  10K  [R0402]
R246  3.9K  [R0402]
R247  2K  [R0402]
U8  OPA4197QPWRQ1  [TSSOP-14_L5.0-W4.4-P0.65-LS6.4-BL]  (sections 1,2,3,4)
U16  OPA4197QPWRQ1  [TSSOP-14_L5.0-W4.4-P0.65-LS6.4-BL]  (sections 1,2,3,4)
sheet P4.TIA_3
C124  100pF  [C0402]
C125  100nF  [C0402]
C126  100nF  [C0402]
C127  100nF  [C0402]
C131  33nF  [C0402]
C132  100pF  [C0402]
C133  100pF  [C0402]
C134  100nF  [C0402]
C135  100nF  [C0402]
C136  100nF  [C0402]
C137  100nF  [C0402]
C138  100nF  [C0402]
C143  33nF  [C0402]
C144  100pF  [C0402]
C145  100nF  [C0402]
C146  100nF  [C0402]
CN7  PJ-320D  [AUDIO-SMD_PJ-320D]
CN8  PJ-320D  [AUDIO-SMD_PJ-320D]
CN13  HC-1.0-4PWT  [CONN-SMD_4P-P1.00_HCTL_HC-1.0-4PWT]
CN14  HC-1.0-4PWT  [CONN-SMD_4P-P1.00_HCTL_HC-1.0-4PWT]
D19  NUP2105LT1G  [SOT-23-3_L2.9-W1.3-P1.90-LS2.4-BR]
D20  NUP2105LT1G  [SOT-23-3_L2.9-W1.3-P1.90-LS2.4-BR]
D21  NUP2105LT1G  [SOT-23-3_L2.9-W1.3-P1.90-LS2.4-BR]
D22  NUP2105LT1G  [SOT-23-3_L2.9-W1.3-P1.90-LS2.4-BR]
R141  10kΩ  [R0402]
R142  10kΩ  [R0402]
R171  10kΩ  [R0402]
R172  10kΩ  [R0402]
R173  2kΩ  [R0402]
R174  2kΩ  [R0402]
R178  2.2K  [R0402]
R179  750Ω  [R0402]
R184  2kΩ  [R0402]
R185  2kΩ  [R0402]
R186  2.2K  [R0402]
R187  750Ω  [R0402]
R230  1kΩ  [R0402]
R231  10kΩ  [R0402]
R232  750Ω  [R0402]
R236  1kΩ  [R0402]
R237  10kΩ  [R0402]
R238  750Ω  [R0402]
R248  10K  [R0402]
R249  3.9K  [R0402]
R250  2K  [R0402]
R251  10K  [R0402]
R252  3.9K  [R0402]
R253  2K  [R0402]
U9  OPA4197QPWRQ1  [TSSOP-14_L5.0-W4.4-P0.65-LS6.4-BL]  (sections 1,2,3,4)
U41  OPA4197QPWRQ1  [TSSOP-14_L5.0-W4.4-P0.65-LS6.4-BL]  (sections 1,2,3,4)

## Library data of the parts
C1 C5 = CL05A225MQ5NSNC: 容值:2.2uF;精度:±20%;额定电压:6.3V;材质(温度系数):X5R;; LCSC Part Name: 2.2uF ±20% 6.3V; Supplier Part: C12530; Manufacturer: SAMSUNG(三星); Supplier Footprint: 0402; JLCPCB Part Class: Basic Part; Datasheet: https://atta.szlcsc.com/upload/public/pdf/source/20160103/1457707666860.pdf; Supplier: LCSC; Tolerance: ±20%; Voltage Rated: 6.3V; Temperature Coefficient: X5R
C2-C4 C17-C19 = CC0402KRX7R7BB104: 容值:100nF;精度:±10%;额定电压:16V;材质(温度系数):X7R;; LCSC Part Name: 100nF ±10% 16V; Supplier Part: C60474; Manufacturer: YAGEO(国巨); Supplier Footprint: 0402; JLCPCB Part Class: Extended Part; Datasheet: https://atta.szlcsc.com/upload/public/pdf/source/20211223/9278FD768280B81DDBEF48FA36411A03.pdf; Supplier: LCSC; Tolerance: ±10%; Voltage Rated: 16V; Temperature Coefficient: X7R
C45 C49 = CL05A475MP5NRNC: 容值:4.7uF;精度:±20%;额定电压:10V;材质(温度系数):X5R;; LCSC Part Name: 4.7uF ±20% 10V; Supplier Part: C23733; Manufacturer: SAMSUNG(三星); Supplier Footprint: 0402; JLCPCB Part Class: 基础库; Datasheet: https://atta.szlcsc.com/upload/public/pdf/source/20160218/1457707763339.pdf; Supplier: LCSC; Tolerance: ±20%; Voltage Rated: 10V; Temperature Coefficient: X5R
C46 = 0402CG120J500NT: 容值:12pF;精度:±5%;额定电压:50V;材质(温度系数):C0G;; LCSC Part Name: 12pF ±5% 50V; Supplier Part: C1547; Manufacturer: FH(风华); Supplier Footprint: 0402; JLCPCB Part Class: 基础库; Datasheet: https://atta.szlcsc.com/upload/public/pdf/source/20200305/C486355_26A10D38EF8C2A5C37091D0039909270.pdf; Supplier: LCSC; Tolerance: ±5%; Voltage Rated: 50V; Temperature Coefficient: C0G
C47 C48 C63 C64 = CL05B104KB54PNC: 容值:100nF;精度:±10%;额定电压:50V;材质(温度系数):X7R;; LCSC Part Name: 100nF ±10% 50V; Supplier Part: C307331; Manufacturer: SAMSUNG(三星); Supplier Footprint: 0402; JLCPCB Part Class: 基础库; Datasheet: https://atta.szlcsc.com/upload/public/pdf/source/20160218/1457707763339.pdf; Supplier: LCSC; Tolerance: ±10%; Voltage Rated: 50V; Temperature Coefficient: X7R
CN9-CN14 CN16-CN18 = HC-1.0-4PWT: 插针结构:1x4P;间距:1mm;安装方式:卧贴;参考系列:-;总PIN数:4P;排数:1;每排PIN数:4;行距:-;额定电流:1A;触头材质:磷青铜;触头镀层:锡;工作温度范围:-25℃~+85℃;; LCSC Part Name: 1x4P 间距:1mm 卧贴; Supplier Part: C2845363; Manufacturer: HCTL(华灿天禄); Supplier Footprint: SMD,P=1mm,卧贴; JLCPCB Part Class: 扩展库; Datasheet: https://atta.szlcsc.com/upload/public/pdf/source/20230707/696F47DD5B3D5495B4AB8BCE302E8A84.pdf; Supplier: LCSC; Pins Structure: 1x4P; Pitch: 1mm; Mounting Style: 卧贴; Number of Pins: 4P; Number of Rows: 1; Number of PINs Per Row: 4; Current Rating (Max): 1A; Contact Material: 磷青铜; Contact Plating: 锡; Operating Temperature Range: -25℃~+85℃
LED4 LED6 = NCD0603G1: 发光颜色:翠绿色;正向电压(VF):2.6V~3.6V;功率:72mW;正向电流:10mA;主波长:515nm~530nm;透镜颜色:无色透明透镜;发光强度:330mcd~900mcd;发光角度:130°;工作温度:-30℃~+85℃;; Supplier Part: C84267; Manufacturer: 国星光电; Supplier Footprint: 0603; JLCPCB Part Class: 扩展库; Datasheet: https://atta.szlcsc.com/upload/public/pdf/source/20200820/C84267_04BA7703640BAC111D09F5EFB971FBF3.pdf; Supplier: LCSC; Emitted Color: 翠绿色; Forward Voltage (VF): 2.6V~3.6V; Power Dissipation: 72mW; Forward Current: 10mA; Dominant Wavelength: 515nm~530nm; Lens Color: 无色透明透镜; Luminous Intensity: 330mcd~900mcd; Viewing Angle: 130°; Operating Temperature: -30℃~+85℃
LED5 = NCD0603B1: 发光颜色:蓝色;正向电压(VF):2.6V~3.6V;功率:72mW;正向电流:10mA;主波长:463nm~475nm;透镜颜色:无色透明透镜;发光强度:80mcd~220mcd;发光角度:130°;工作温度:-30℃~+85℃;; Supplier Part: C84266; Manufacturer: 国星光电; Supplier Footprint: 0603; JLCPCB Part Class: 扩展库; Datasheet: https://atta.szlcsc.com/upload/public/pdf/source/20200820/C84266_6A3CDBEFA72C6CAD68EDA53474ADAE6C.pdf; Supplier: LCSC; Emitted Color: 蓝色; Forward Voltage (VF): 2.6V~3.6V; Power Dissipation: 72mW; Forward Current: 10mA; Dominant Wavelength: 463nm~475nm; Lens Color: 无色透明透镜; Luminous Intensity: 80mcd~220mcd; Viewing Angle: 130°; Operating Temperature: -30℃~+85℃
R24 R64 R188 R189 = 0402WGF1003TCE: 电阻类型:厚膜电阻;阻值:100kΩ;精度:±1%;功率:62.5mW;温度系数:±100ppm/℃;最大工作电压:50V;工作温度范围:-55℃~+155℃;; LCSC Part Name: 100kΩ ±1% 62.5mW; Supplier Part: C25741; Manufacturer: UNI-ROYAL(厚声); Supplier Footprint: 0402; JLCPCB Part Class: Basic Part; Datasheet: https://atta.szlcsc.com/upload/public/pdf/source/20200306/C422600_1E6D84923E4A46A82E41ADD87F860B5C.pdf; Supplier: LCSC; Type: 厚膜电阻; Tolerance: ±1%; Power(Watts): 62.5mW; Temperature Coefficient: ±100ppm/℃; Overload Voltage (Max): 50V; Operating Temperature Range: -55℃~+155℃
R58 = RC0402FR-0710KL: 电阻类型:厚膜电阻;阻值:10kΩ;精度:±1%;功率:62.5mW;最大工作电压:50V;温度系数:±100ppm/℃;; LCSC Part Name: 厚膜电阻 10kΩ ±1% 62.5mW; Supplier Part: C60490; Manufacturer: YAGEO(国巨); Supplier Footprint: 0402; JLCPCB Part Class: 扩展库; Datasheet: https://atta.szlcsc.com/upload/public/pdf/source/20170925/C131467_1506321478108990263.pdf; Supplier: LCSC; Type: 厚膜电阻; Tolerance: ±1%; Power(Watts): 62.5mW; Overload Voltage (Max): 50V; Temperature Coefficient: ±100ppm/℃; Operating Temperature Range: -55℃~+155℃
SW1 = TS-1088R-02026: 电路结构:单刀单掷;按钮形状:圆形按钮;安装方式:立贴;开关长度:3.9mm;开关宽度:2.93mm;开关高度:2mm;触点电流:50mA;额定电压(DC):12V;带灯:-;机械寿命:-;; LCSC Part Name: 3.9*2.93*2mm 立贴 轻触开关; Supplier Part: C455280; Manufacturer: XUNPU(讯普); Supplier Footprint: SMD,3x4mm; JLCPCB Part Class: 扩展库; Datasheet: https://atta.szlcsc.com/upload/public/pdf/source/20191118/C455281_EC5379764BC1462550DF64BBBFEA9579.pdf; Supplier: LCSC; Circuit: 单刀单掷; Actuator Style: 圆形按钮; Mounting Style: 立贴; Switch Length: 3.9mm; Switch Width: 2.93mm; Switch Height: 2mm; Contact Current: 50mA; Voltage Rating (DC): 12V
SW4 = TS-1088-AR02016: 电路结构:单刀单掷;按钮形状:圆形按钮;作用力:160gf;安装方式:立贴;开关长度:4mm;开关宽度:3mm;开关高度:2mm;带支架:不带;触点电流:50mA;额定电压(DC):12V;绝缘电阻:100MΩ;机械寿命:10万次;; LCSC Part Name: 4*3*2mm 立贴 轻触开关; Supplier Part: C720477; Manufacturer: XUNPU(讯普); Supplier Footprint: SMD; JLCPCB Part Class: 扩展库; Datasheet: https://atta.szlcsc.com/upload/public/pdf/source/20200810/C720475_60D09DD6C54279ADDB2DC25100F1CC11.pdf; Supplier: LCSC; Circuit: 单刀单掷; Actuator Style: 圆形按钮; Operating Force: 160gf; Mounting Style: 立贴; Switch Length: 4mm; Switch Width: 3mm; Switch Height: 2mm; Strike Gundam: 不带; Contact Current: 50mA; Voltage Rating (DC): 12V; Insulation Resistance: 100MΩ; Actuator/Cap Color: 黑色; Pin Style: SMD接片; Mechanical Life: 10万次; Operating Temperature: -30℃~+80℃
TP1 TP2 = M2螺丝: Supplier Footprint: 插件
U1 = CH582F: Supplier Part: C3001175; Manufacturer: WCH(南京沁恒); Supplier Footprint: QFN-28; JLCPCB Part Class: Extended Part; Datasheet: https://atta.szlcsc.com/upload/public/pdf/source/20220425/D81D4537E275CD6C7C3E77BC95B144F3.pdf; Supplier: LCSC
U2 = STM32L432KCU6: CPU内核:CM4;程序存储容量:256KB;RAM总容量:64KB;GPIO端口数量:26;工作电压范围:1.71V~3.6V;CPU最大主频:80MHz;程序存储器类型:FLASH;; Supplier Part: C1337280; Manufacturer: ST(意法半导体); Supplier Footprint: UFQFPN-32(5x5); JLCPCB Part Class: 扩展库; Datasheet: https://atta.szlcsc.com/upload/public/pdf/source/20210121/C1337280_6043F2ED9796FD4C4AFE3B790095774B.pdf; Supplier: LCSC; CPU Core: CM4; Program Storage Size: 256KB; RAM Size: 64KB; GPIO Ports Number: 26; Operating Voltage Range: 1.71V~3.6V; CPU Maximum Speed: 80MHz; Program Memory Type: FLASH; Operating Temperature Range: -40℃~+85℃; ADC (Bit): 12bit; DAC (Bit): 12bit; Universal Serial Bus: 有; Peripheral/Function: 看门狗；看门狗；PWM; Watchdog: 有; Infrared Data Association: 有; Direct Memory Access: 有; Internal Oscillator: 有
U21 = 嘉立创二维码5x5
U29 = BWU.FL-IPEX1: 连接器类型:板端;射频系列:IPEX;接口类型:内针;端口数量:1;阻抗:50Ω;频率-最大值:6GHz;接口直径:2mm;接口长度/高度:1.25mm;工作温度范围:260℃;; LCSC Part Name: IPEX 内针; Supplier Part: C5137195; Manufacturer: BAT WIRELESS(蝙蝠无线); Supplier Footprint: SMD; JLCPCB Part Class: 扩展库; Datasheet: https://atta.szlcsc.com/upload/public/pdf/source/20220815/058ABE525AAE400925F1A3839AB872AC.pdf; Supplier: LCSC; Connector Type: 板端; RF Series: IPEX; Interface Type: 内针; Number of Ports: 1; Impedance: 50Ω; Frequency-Max: 6GHz; Interface Diameter: 2mm; Interface Length/Height: 1.25mm; Operating Temperature Range: 260℃
U42 = XL7EL89COI-111YLC-32M: 频率:32MHz;频率公差:±10ppm;负载电容:12pF;; LCSC Part Name: 32MHz ±10ppm 12pF YSX211SL; Supplier Part: C2965584; Manufacturer: YXC(扬兴晶振); Supplier Footprint: SMD2016-4P; JLCPCB Part Class: Extended Part; Datasheet: https://atta.szlcsc.com/upload/public/pdf/source/20220121/6B4B3E7EF7974858943D806BF8CACEA3.pdf; Supplier: LCSC; Crystal Type: 贴片无源晶振; Frequency Tolerance: ±10ppm; Frequency Stability: ±20ppm; Load Capacitance: 12pF; Operating Temperature: -40℃~+85℃
U44 = WAFER-SH1.0-3PWB: 插针结构:1x3P;间距:1mm;安装方式:卧贴;总PIN数:3P;排数:1;每排PIN数:3;额定电流:1A;工作温度范围:-25℃~+85℃;; LCSC Part Name: 1x3P 间距:1mm 卧贴; Supplier Part: C3029342; Manufacturer: XUNPU(讯普); Supplier Footprint: SMD,P=1mm,卧贴; JLCPCB Part Class: 扩展库; Datasheet: https://atta.szlcsc.com/upload/public/pdf/source/20220527/1879B8210BD3B2006BCEAC1A40D397B6.pdf; Supplier: LCSC; Pins Structure: 1x3P; Pitch: 1mm; Mounting Style: 卧贴; Number of Pins: 3P; Number of Rows: 1; Number of PINs Per Row: 3; Current Rating (Max): 1A; Operating Temperature Range: -25℃~+85℃
X6 = X321532768KGD2SI: 频率:32.768kHz;负载电容:12.5pF;频率公差:±20ppm;; LCSC Part Name: 32.768kHz ±20ppm 12.5pF YST310S; Supplier Part: C620155; Manufacturer: YXC(扬兴晶振); Supplier Footprint: SMD3215-2P; JLCPCB Part Class: 扩展库; Datasheet: https://atta.szlcsc.com/upload/public/pdf/source/20210329/C620155_E5A74FC0D27C5E9015A8D75DE9484FEA.pdf; Supplier: LCSC; Crystal Type: 贴片无源晶振; Load Capacitance: 12.5pF; Frequency Tolerance: ±20ppm; Operating Temperature: -40℃~+85℃
C147-C151 = CL05A106MQ5NUNC: 容值:10uF;精度:±20%;额定电压:6.3V;材质(温度系数):X5R;; LCSC Part Name: 10uF ±20% 6.3V; Supplier Part: C15525; Manufacturer: SAMSUNG(三星); Supplier Footprint: 0402; JLCPCB Part Class: 基础库; Datasheet: https://atta.szlcsc.com/upload/public/pdf/source/20220823/2B02EE04F8F211D38A52DCB16EB6BEBA.pdf; Supplier: LCSC; Tolerance: ±20%; Voltage Rated: 6.3V; Temperature Coefficient: X5R
C152-C158 = CL05B103KB5NNNC: 容值:10nF;精度:±10%;额定电压:50V;材质(温度系数):X7R;; LCSC Part Name: 10nF±10%50V; Supplier Part: C15195; Manufacturer: SAMSUNG(三星); Supplier Footprint: 0402; JLCPCB Part Class: BasicPart; Datasheet: https://atta.szlcsc.com/upload/public/pdf/source/20160103/1457707674468.pdf; Supplier: LCSC; Tolerance: ±10%; Voltage Rated: 50V; Temperature Coefficient: X7R
C159-C170 = GRM188R61E106KA73D: 容值:10uF;精度:±10%;额定电压:25V;材质(温度系数):X5R;; LCSC Part Name: 10uF ±10% 25V; Supplier Part: C344022; Manufacturer: muRata(村田); Supplier Footprint: 0603; JLCPCB Part Class: 扩展库; Datasheet: https://atta.szlcsc.com/upload/public/pdf/source/20181211/C344022_BB98D43E7DA95E5A749FBFE073C8A3E0.pdf; Supplier: LCSC; Tolerance: ±10%; Voltage Rated: 25V; Temperature Coefficient: X5R
C173 C174 = GRM155R61H105KE05D: 容值:1uF;精度:±10%;额定电压:50V;材质(温度系数):X5R;; LCSC Part Name: 1uF ±10% 50V; Supplier Part: C1518208; Manufacturer: muRata(村田); Supplier Footprint: 0402; JLCPCB Part Class: 扩展库; Datasheet: https://atta.szlcsc.com/upload/public/pdf/source/20210607/3F03D47137F6EC7729AB4067EB2A6EB3.pdf; Supplier: LCSC; Tolerance: ±10%; Voltage Rated: 50V; Temperature Coefficient: X5R
D23-D27 = 1N5819WS_C191023: 正向压降(Vf):600mV@1A;直流反向耐压(Vr):40V;平均整流电流(Io):1A;; LCSC Part Name: 电压:40V 电流:1A; Supplier Part: C191023; Manufacturer: Hottech(合科泰); Supplier Footprint: SOD-323; JLCPCB Part Class: 基础库; Datasheet: https://atta.szlcsc.com/upload/public/pdf/source/20220428/3CB86FD8D28D653594B4E35F9D5AEFD9.pdf; Supplier: LCSC; Forward Voltage (Vf@If): 600mV@1A; Reverse Voltage (Vr): 40V; Average Rectified Current (Io): 1A
D28 = SRV05-4_C7420376: 极性:双向;反向截止电压(Vrwm):5V;最大钳位电压:12.5V;峰值脉冲电流(Ipp)@10/1000us:5A;峰值脉冲功率(Ppp)@10/1000us:75W;击穿电压:6V;; Supplier Part: C7420376; Manufacturer: 宏迦橙; Supplier Footprint: SOT-23-6; JLCPCB Part Class: 扩展库; Datasheet: https://atta.szlcsc.com/upload/public/pdf/source/20230828/F004AC78311BDA423A4CF92C82471CEB.pdf; Supplier: LCSC; polarity: 双向; Reverse Stand-Off Voltage (Vrwm): 5V; Maximum Clamping Voltage: 12.5V; Peak Pulse Current (Ipp)@10/1000us: 5A; Peak Pulse Power Dissipation (Ppp)@10/1000us: 75W; Breakdown Voltage: 6V; Reverse Leakage Current (Ir): 1uA; Number of Lines: 五路; Operating Temperature: -55℃~+155℃; Type: TVS
L1 L2 L4 L6 = BLM18AG601SN1D: 标称阻抗@测试频率:600Ω@100MHz;误差:±25%;直流电阻(RDC):380mΩ;; LCSC Part Name: 单路 0603磁珠 阻抗600Ω@100MHz; Supplier Part: C19330; Manufacturer: muRata(村田); Supplier Footprint: 0603; JLCPCB Part Class: 扩展库; Datasheet: https://atta.szlcsc.com/upload/public/pdf/source/20180329/C160981_FD3C2D2622A377E203B89F4AA32B0741.pdf; Supplier: LCSC; Impedance @ Frequency: 600Ω@100MHz; Tolerance: ±25%; DC Resistance: 380mΩ; Current Rating: 500mA; Circuits: 1
L9 L10 = BCIHP0420SC-100M: 电感值:10uH;精度:±20%;额定电流:1.3A;饱和电流(Isat):2A;直流电阻(DCR):282mΩ;; LCSC Part Name: 10uH ±20% 2A; Supplier Part: C2921170; Manufacturer: BC(台湾诚阳); Supplier Footprint: SMD,4.2x4.4mm; JLCPCB Part Class: 扩展库; Datasheet: https://atta.szlcsc.com/upload/public/pdf/source/20220607/0F62A2B68923DD0945D5F83B99590D06.pdf; Supplier: LCSC; Tolerance: ±20%; Rated Current: 1.3A; Saturation Current (Isat): 2A; DC Resistance (DCR): 282mΩ
LED2 = LED_0603-R: 发光颜色:红灯;二极管配置:-;透镜颜色:无色透明;主波长:617.5nm;峰值波长:632nm;色温:-;光通量(25时):-;测试电流:5mA;正向电压(VF):2.2V;发光强度:28.5mcd;功率:60mW;发光角度:120°;安装方式:-;工作温度:-40~+85;; Supplier Footprint: 0603
LED3 = LED_0603-G: Supplier Footprint: 0603
Q1 = AO3401A_C15127: 类型:P沟道;漏源电压(Vdss):30V;连续漏极电流(Id):4A;功率(Pd):1.4W;导通电阻(RDS(on)@Vgs,Id):44mΩ@10V,4.3A;; LCSC Part Name: P沟道 30V 4A; Supplier Part: C15127; Manufacturer: AOS; Supplier Footprint: SOT-23-3L; JLCPCB Part Class: 基础库; Datasheet: https://atta.szlcsc.com/upload/public/pdf/source/20160507/1462613609053.pdf; Supplier: LCSC; Type: P沟道; Drain Source Voltage (Vdss): 30V; Continuous Drain Current (Id): 4A; Power Dissipation (Pd): 1.4W; Drain Source On Resistance (RDS(on)@Vgs,Id): 44mΩ@10V,4.3A; Gate Threshold Voltage (Vgs(th)@Id): 1.3V@250uA
R2 R3 R5 R6 R9 R16-R20 R26-R30 R39-R43 R49 R50 R53 R55 R59-R63 R65 R66 R87 R93 R94 R100 R103 R132-R135 R139-R142 R171-R174 R178-R187 R208 R239-R253 = Res_0402: Supplier Footprint: 0402
R54 = 0402WGF1542TCE: 电阻类型:厚膜电阻;阻值:15.4kΩ;精度:±1%;功率:62.5mW;最大工作电压:50V;温度系数:±100ppm/℃;; LCSC Part Name: 15.4kΩ ±1% 62.5mW 厚膜电阻; Supplier Part: C62740; Manufacturer: UNI-ROYAL(厚声); Supplier Footprint: 0402; JLCPCB Part Class: 扩展库; Datasheet: https://atta.szlcsc.com/upload/public/pdf/source/20200306/C422600_1E6D84923E4A46A82E41ADD87F860B5C.pdf; Supplier: LCSC; Type: 厚膜电阻; Tolerance: ±1%; Power(Watts): 62.5mW; Overload Voltage (Max): 50V; Temperature Coefficient: ±100ppm/℃; Operating Temperature Range: -55℃~+155℃
R56 = 0402WGF1203TCE: 电阻类型:厚膜电阻;阻值:120kΩ;精度:±1%;功率:62.5mW;最大工作电压:50V;温度系数:±100ppm/℃;; LCSC Part Name: 120kΩ ±1% 62.5mW 厚膜电阻; Supplier Part: C25750; Manufacturer: UNI-ROYAL(厚声); Supplier Footprint: 0402; JLCPCB Part Class: 扩展库; Datasheet: https://atta.szlcsc.com/upload/public/pdf/source/20200306/C422600_1E6D84923E4A46A82E41ADD87F860B5C.pdf; Supplier: LCSC; Type: 厚膜电阻; Tolerance: ±1%; Power(Watts): 62.5mW; Overload Voltage (Max): 50V; Temperature Coefficient: ±100ppm/℃; Operating Temperature Range: -55℃~+155℃
R57 = RC0402FR-075KL: 电阻类型:厚膜电阻;阻值:5kΩ;精度:±1%;功率:62.5mW;最大工作电压:50V;温度系数:±100ppm/℃;; LCSC Part Name: 厚膜电阻 5kΩ ±1% 62.5mW; Supplier Part: C477765; Manufacturer: YAGEO(国巨); Supplier Footprint: 0402; JLCPCB Part Class: 扩展库; Datasheet: https://atta.szlcsc.com/upload/public/pdf/source/20200715/C477765_7B5FC8325F065A7C97D0E958BF6567D2.pdf; Supplier: LCSC; Type: 厚膜电阻; Tolerance: ±1%; Power(Watts): 62.5mW; Overload Voltage (Max): 50V; Temperature Coefficient: ±100ppm/℃; Operating Temperature Range: -55℃~+155℃
SW3 = MSK12C02: 电路结构:单刀双掷;安装方式:卧贴;开关颜色:-;额定电流(DC):50mA;额定电压(DC):12V;额定电流(AC):-;额定电压(AC):-;机械寿命:1万次;; LCSC Part Name: 两档侧拨贴片 7脚 滑动开关; Supplier Part: C431540; Manufacturer: SHOU HAN(首韩); Supplier Footprint: SMD; JLCPCB Part Class: 扩展库; Datasheet: https://atta.szlcsc.com/upload/public/pdf/source/20190925/C431540_89155AEF0758B9AD1B2D805F83FB12E3.pdf; Supplier: LCSC; Circuit: 单刀双掷; Pin Style: SMD接片; Switch Length: 8mm; Switch Width: 2.8mm; Switch Height: 1.4mm; Mounting Style: 卧贴; Current Rating (DC): 50mA; Voltage Rating (DC): 12V; Mechanical Life: 1万次; Operating Temperature: -20℃~+70℃
U12 = TP4056_C725790: Supplier Part: C725790; Manufacturer: UMW(友台半导体); Supplier Footprint: ESOP-8; JLCPCB Part Class: Extended Part; Datasheet: https://atta.szlcsc.com/upload/public/pdf/source/20231109/CF74897CE79A500F7FE27A45ADCCC631.pdf; Supplier: LCSC
U15 = SGM2036-3.3YN5G/TR: 输出类型:固定;最大输入电压:5.5V;输出电压:3.3V;输出电流:300mA;电源纹波抑制比(PSRR):82dB;输出极性:正;; LCSC Part Name: 输入5.5V 输出3.3V 300mA; Supplier Part: C92402; Manufacturer: SGMICRO(圣邦微); Supplier Footprint: SOT-23-5; JLCPCB Part Class: 扩展库; Datasheet: https://atta.szlcsc.com/upload/public/pdf/source/20220916/5AE9C7E1D57E737862D3B9D7C5304993.pdf; Supplier: LCSC; Output Type: 固定; Maximum Input Voltage: 5.5V; Output Voltage: 3.3V; Output Current: 300mA; Power Supply Rejection Ratio (PSRR): 82dB; Dropout Voltage: 250mV@(300mA); Output Polarity: 正; Number of Outputs: 1
U22 U27 = MT3608L: Supplier Part: C2932326; Manufacturer: 西安航天民芯; Supplier Footprint: SOT-23-6; JLCPCB Part Class: 扩展库; Datasheet: https://atta.szlcsc.com/upload/public/pdf/source/20211213/953A62CC1033762E00AABAD4906DD7F1.pdf; Supplier: LCSC
U25 U26 = TPS7A4901DGNT: 输出类型:可调;输出极性:正;最大输入电压:35V;输出电压:1.194V~33V;输出电流:150mA;电源纹波抑制比(PSRR):78dB@(1kHz);; Supplier Part: C61422; Manufacturer: TI(德州仪器); Supplier Footprint: MSOP-8-EP; JLCPCB Part Class: 扩展库; Datasheet: https://atta.szlcsc.com/upload/public/pdf/source/20151024/1457707496858.pdf; Supplier: LCSC; Output Type: 可调; Output Polarity: 正; Number of Outputs: 1; Maximum Input Voltage: 35V; Output Voltage: 1.194V~33V; Dropout Voltage: 450mV@(1A); Output Current: 150mA; Power Supply Rejection Ratio (PSRR): 78dB@(1kHz)
U28 = TPS7A3001DGNR: 输出类型:可调;输出极性:负;最大输入电压:35V;输出电压:1.18V~33V;输出电流:200mA;; LCSC Part Name: ADJ 输入35V 输出1.18V~33V 200mA; Supplier Part: C33835; Manufacturer: TI(德州仪器); Supplier Footprint: HVSSOP-8; JLCPCB Part Class: 扩展库; Datasheet: https://atta.szlcsc.com/upload/public/pdf/source/20140801/1457707196067.pdf; Supplier: LCSC; Output Type: 可调; Maximum Input Voltage: 35V; Output Voltage: 1.18V~33V; MAX Output Current: 200mA; Power Supply Rejection Ratio (PSRR): 72dB@(120Hz); Dropout Voltage: 600mV@(200mA); standby current: 100uA; Operating Temperature: -40℃~+125℃; Output Polarity: 负; Number of Outputs: 1; Output Current: 200mA
U43 = WAFER-SH1.0-2PWB: 插针结构:1x2P;间距:1mm;安装方式:卧贴;总PIN数:2P;排数:1;每排PIN数:2;额定电流:1A;工作温度范围:-25℃~+85℃;; LCSC Part Name: 1x2P 间距:1mm 卧贴; Supplier Part: C3029341; Manufacturer: XUNPU(讯普); Supplier Footprint: SMD,P=1mm,卧贴; JLCPCB Part Class: 扩展库; Datasheet: https://atta.szlcsc.com/upload/public/pdf/source/20220527/1879B8210BD3B2006BCEAC1A40D397B6.pdf; Supplier: LCSC; Pins Structure: 1x2P; Pitch: 1mm; Mounting Style: 卧贴; Number of Pins: 2P; Number of Rows: 1; Number of PINs Per Row: 2; Current Rating (Max): 1A; Operating Temperature Range: -25℃~+85℃
USB1 = KH-TYPE-C-16P: 连接器类型:Type-C;标准:-;公母:母座;触点数量:16;端口数量:1;安装方式:卧贴;额定电流 - 电源:3A;工作温度范围:-40~+85;; LCSC Part Name: Type-C 母座 卧贴; Supplier Part: C709357; Manufacturer: kinghelm(金航标); Supplier Footprint: SMD; JLCPCB Part Class: 扩展库; Datasheet: https://atta.szlcsc.com/upload/public/pdf/source/20200911/C709357_AA8DCEB38BB20E3035A7ED7AE7667837.pdf; Supplier: LCSC; Connector Type: Type-C; Gender: 母座; Number of Contacts: 16; Number of Ports: 1; Mounting Style: 卧贴; Current Rating - Power (Max): 3A; Operating Temperature Range: -40~+85
C14-C16 C20-C24 C27 C28 C31 C38 C40 C44 C50 C51 C59-C62 C65 C72-C77 C84-C86 C89 C96 C103-C106 C110-C117 C124-C127 C131-C146 = CAP_0402: Supplier Footprint: 0402
C176 = GRM158R61A226ME15D: 容值:22uF;精度:±20%;额定电压:10V;材质(温度系数):X5R;; LCSC Part Name: 22uF ±20% 10V; Supplier Part: C3845593; Manufacturer: muRata(村田); Supplier Footprint: 0402; JLCPCB Part Class: 扩展库; Datasheet: https://atta.szlcsc.com/upload/public/pdf/source/20230811/016E9304DA64D47AB1EFBD6C89B0D146.pdf; Supplier: LCSC; Tolerance: ±20%; Voltage Rated: 10V; Temperature Coefficient: X5R
U3 = DAC8568ICPWR: DAC8568 具有 2.5V、2ppm/°C 内部基准的 16 位、八通道、超低毛刺脉冲、电压输出 DAC; Supplier Part: C524819; Manufacturer: TI(德州仪器); Supplier Footprint: TSSOP-16; JLCPCB Part Class: 扩展库; Datasheet: https://atta.szlcsc.com/upload/public/pdf/source/20200429/C524819_26135D5259078B65C5D1A6D5DC913049.pdf; Supplier: LCSC
U20 U30 = ADS1256IDBR: 接口:SPI;电源电压:5V;采样率:30kHz;分辨率:24位;; LCSC Part Name: 4或8通道 30kHz 24位ADC SPI接口; Supplier Part: C28186; Manufacturer: TI(德州仪器); Supplier Footprint: SSOP-28-208mil; JLCPCB Part Class: 扩展库; Datasheet: https://www.ti.com/cn/lit/gpn/ads1256; Supplier: LCSC; Interface: SPI; differential input: 是; number of channels: 4；8; Supply Voltage: 5V; sampling frequency: 30kHz; resolution: 24位; Operating Temperature: -40℃~+85℃
U31 = REF5025AIDR: 输出类型:固定;输入电压:2.7V~18V;输出电压:2.5V;输出电流:10mA;精度:±0.1%;; Supplier Part: C11341; Manufacturer: TI(德州仪器); Supplier Footprint: SOIC-8; JLCPCB Part Class: 扩展库; Datasheet: https://www.ti.com/cn/lit/gpn/ref5025; Supplier: LCSC; Output Type: 固定; Input Voltage: 2.7V~18V; Output Voltage: 2.5V; Output Current: 10mA; Tolerance: ±0.1%; Temperature Coefficient: 8ppm/℃; Reference Type: 串联; Supply Current: 1.2mA; Noise - 1/10Hz to 10Hz: 3uVp-p; Operating Temperature: -40℃~+125℃@(Ta)
X5 X7 = X32258MOB4SI: 晶振类型:贴片晶振;频率:8MHz;常温频差:±10ppm;外接负载电容:12pF;频率稳定度(全温):±20ppm;; LCSC Part Name: 8MHz ±10ppm 12pF; Supplier Part: C2682775; Manufacturer: YXC(扬兴晶振); Supplier Footprint: SMD3225-4P; JLCPCB Part Class: 扩展库; Datasheet: https://atta.szlcsc.com/upload/public/pdf/source/20240329/19D5F850207469550BEB00D7DFEDBC7A.pdf; Supplier: LCSC; Crystal Type: 贴片晶振; Normal temperature Frequency Tolerance: ±10ppm; External load capacitor: 12pF; Frequency Stability(Full temperature range): ±20ppm; Equivalent Series Resistance (ESR): 150Ω; Operating Temperature: -40℃~+85℃
CN3-CN8 = PJ-320D_C431535: 连接器类型:3.5mm耳机座;额定电流:300mA;额定电压:50V;工作温度范围:-16℃~+65℃;; LCSC Part Name: 3.5mm耳机座; Supplier Part: C431535; Manufacturer: SHOU HAN(首韩); Supplier Footprint: SMD; JLCPCB Part Class: 扩展库; Datasheet: https://atta.szlcsc.com/upload/public/pdf/source/20190925/C431535_8B274506621F6117FB020BF07A197848.pdf; Supplier: LCSC; Connector Type: 3.5mm耳机座; Current Rating (Max): 300mA; Voltage Rating (Max): 50V; Operating Temperature Range: -16℃~+65℃
D5 D6 D13-D22 = NUP2105LT1G_C2890118: Supplier Part: C2890118; Manufacturer: TECH PUBLIC(台舟); Supplier Footprint: SOT-23; JLCPCB Part Class: 扩展库; Datasheet: https://atta.szlcsc.com/upload/public/pdf/source/20210903/C2631C2D315C3B4D2530AFC6AAB84809.pdf; Supplier: LCSC
R190 R212 R218 R224 R230 R236 = 0402WGF5101TCE: 电阻类型:厚膜电阻;阻值:5.1kΩ;精度:±1%;功率:62.5mW;最大工作电压:50V;温度系数:±100ppm/℃;; LCSC Part Name: 5.1kΩ ±1% 62.5mW 厚膜电阻; Supplier Part: C25905; Manufacturer: UNI-ROYAL(厚声); Supplier Footprint: 0402; JLCPCB Part Class: 基础库; Datasheet: https://atta.szlcsc.com/upload/public/pdf/source/20200306/C422600_1E6D84923E4A46A82E41ADD87F860B5C.pdf; Supplier: LCSC; Type: 厚膜电阻; Tolerance: ±1%; Power(Watts): 62.5mW; Overload Voltage (Max): 50V; Temperature Coefficient: ±100ppm/℃; Operating Temperature Range: -55℃~+155℃
R191 R213 R219 R225 R231 R237 = 0402WGF2202TCE: 电阻类型:厚膜电阻;阻值:22kΩ;精度:±1%;功率:62.5mW;最大工作电压:50V;温度系数:±100ppm/℃;; LCSC Part Name: 22kΩ ±1% 62.5mW 厚膜电阻; Supplier Part: C25768; Manufacturer: UNI-ROYAL(厚声); Supplier Footprint: 0402; JLCPCB Part Class: 基础库; Datasheet: https://atta.szlcsc.com/upload/public/pdf/source/20200306/C422600_1E6D84923E4A46A82E41ADD87F860B5C.pdf; Supplier: LCSC; Type: 厚膜电阻; Tolerance: ±1%; Power(Watts): 62.5mW; Overload Voltage (Max): 50V; Temperature Coefficient: ±100ppm/℃; Operating Temperature Range: -55℃~+155℃
R192 R214 R220 R226 R232 R238 = 0402WGF2001TCE: 电阻类型:厚膜电阻;阻值:2kΩ;精度:±1%;功率:62.5mW;最大工作电压:50V;温度系数:±100ppm/℃;; LCSC Part Name: 2kΩ ±1% 62.5mW 厚膜电阻; Supplier Part: C4109; Manufacturer: UNI-ROYAL(厚声); Supplier Footprint: 0402; JLCPCB Part Class: 基础库; Datasheet: https://atta.szlcsc.com/upload/public/pdf/source/20200306/C422600_1E6D84923E4A46A82E41ADD87F860B5C.pdf; Supplier: LCSC; Type: 厚膜电阻; Tolerance: ±1%; Power(Watts): 62.5mW; Overload Voltage (Max): 50V; Temperature Coefficient: ±100ppm/℃; Operating Temperature Range: -55℃~+155℃
U4 = DG409DQ-T1-E3: 开关电路:单刀四掷(SP4T);通道数:2;导通电阻(Ron@VCC):100Ω;; Supplier Part: C2673358; Manufacturer: VISHAY(威世); Supplier Footprint: TSSOP-16; JLCPCB Part Class: 扩展库; Datasheet: https://atta.szlcsc.com/upload/public/pdf/source/20210702/699D1B7AB87C93CEC1144A5D200B8A11.pdf; Supplier: LCSC; Switch Circuit: 单刀四掷(SP4T); Number of Channels: 2; Supply Voltage: 5V~36V; Turn-on time: 150ns; On-State Resistance (Max): 100Ω; Turn-off time: 150ns
U6-U9 U16 U41 = OPA4197QPWRQ1: 放大器数:四路;增益带宽积(GBP):10MHz;输入偏置电流(Ib):5pA;压摆率(SR):20V/us;轨到轨:-;; Supplier Part: C4366710; Manufacturer: TI(德州仪器); Supplier Footprint: TSSOP-14; JLCPCB Part Class: 扩展库; Datasheet: https://www.ti.com/cn/lit/gpn/opa2197-q1; Supplier: LCSC; Number of Circuits: 四路; Gain Bandwidth Product(GBP): 10MHz; Current - Input Bias(Ib): 5pA; Slew Rate(SR): 20V/us; Output Current: 65mA; Operating Temperature: -40℃~+125℃

## Nets
3V3: C2.2 C24.2 C48.1 C49.1 C63.2 C64.1 C65.2 C74.2 C77.2 C173.2 CN16.4 CN17.4 CN18.4 LED4.2(A) R24.2 R59.2 R60.2 R64.2 R65.2 R66.2 R188.2 U1.5(VIO33/VDD33) U2.1(VDD) U2.5(VDDA/VREF+) U2.17(VDD) U3.9(CLR#) U4.2(EN) U15.5(OUT) U20.16(DVDD) U30.16(DVDD) U44.3
5V: C17.2 C20.2 C75.2 C76.2 C150.1 C151.1 C153.1 L1.1 R50.2 U20.1(AVDD) U26.1(OUT) U30.1(AVDD) U31.2(VIN)
15.8V: C161.2 L4.2 U25.8(IN)
+15V: C40.2 C59.1 C85.2 C105.2 C114.2 C126.2 C135.2 C155.2 C167.1 C168.1 R9.2 U4.14(V+) U6.4(V+) U7.4(V+) U8.4(V+) U9.4(V+) U16.4(V+) U25.1(OUT) U41.4(V+)
-15.8V: C164.1 L2.2 U28.8(IN)
-15V: C38.2 C51.1 C84.2 C104.2 C113.2 C125.2 C134.2 C158.2 C165.1 C166.1 R5.2 U4.3(V-) U6.11(V-) U7.11(V-) U8.11(V-) U9.11(V-) U16.11(V-) U28.1(OUT) U41.11(V-)
GND: C1.1 C2.1 C3.2 C4.2 C5.2 C17.1 C18.1 C19.1 C20.1 C22.1 C23.1 C24.1 C38.1 C40.1 C44.2 C45.1 C46.1 C47.1 C48.2 C49.2 C50.1 C51.2 C59.2 C63.1 C64.2 C65.1 C72.1 C73.1 C74.1 C75.1 C76.1 C77.1 C84.1 C85.1 C86.2 C89.1 C104.1 C105.1 C106.2 C113.1 C114.1 C115.2 C116.1 C125.1 C126.1 C127.2 C134.1 C135.1 C136.2 C137.1 C141.1 C145.1 C147.2 C148.2 C149.1 C150.2 C151.2 C152.2 C154.1 C156.1 C157.1 C159.1 C160.2 C161.1 C163.1 C164.2 C165.2 C166.2 C167.2 C168.2 C169.2 C170.2 C173.1 C174.1 C176.1 CN3.1 CN4.1 CN5.1 CN6.1 CN7.1 CN8.1 CN9.1 CN9.5 CN9.6 CN10.1 CN10.5 CN10.6 CN11.1 CN11.5 CN11.6 CN12.1 CN12.5 CN12.6 CN13.1 CN13.5 CN13.6 CN14.1 CN14.5 CN14.6 CN16.1 CN16.5 CN16.6 CN17.1 CN17.5 CN17.6 CN18.1 CN18.5 CN18.6 D5.3(A) D6.3(A) D13.3(A) D14.3(A) D15.3(A) D16.3(A) D17.3(A) D18.3(A) D19.3(A) D20.3(A) D21.3(A) D22.3(A) D27.1(K) D28.2 R6.1 R28.1 R39.1 R40.1 R42.1 R43.2 R49.1 R54.1 R57.2 R58.2 R62.2 R189.2 R192.1 R214.1 R220.1 R226.1 R232.1 R238.1 R240.1 R243.1 R246.1 R249.1 R252.1 SW1.1 SW3.4 SW4.2 TP1.1 TP2.1 U1.29(EP) U2.16(VSS) U2.32(VSS) U2.33(EP) U3.1(LDAC#) U3.14(GND) U4.15(GND) U6.3(+INA) U7.3(+INA) U8.3(+INA) U9.3(+INA) U12.1(TEMP) U12.3(GND) U12.9(EP) U15.2(GND) U16.3(+INA) U20.2(AGND) U20.3(VREFN) U20.5(AINCOM) U20.17(DGND) U22.2(GND) U25.4(GND) U25.9(EP) U26.4(GND) U26.9(EP) U27.2(GND) U28.4(GND) U28.9(EP) U29.2 U29.3 U30.2(AGND) U30.3(VREFN) U30.5(AINCOM) U30.17(DGND) U31.4(GND) U41.3(+INA) U43.2 U43.3 U43.4 U44.1 U44.4 U44.5 USB1.1(EP) USB1.2(EP) USB1.3(EP) USB1.4(EP) USB1.A1(GND) USB1.A12(GND) USB1.B1(GND) USB1.B12(GND)
VBAT: C170.1 Q1.3(D) U12.5(BAT) U43.1
VBUS: C169.1 D23.2(A) D28.5 Q1.1(G) R41.1 R43.1 U12.4(VCC) U12.8(CE) USB1.A4(VBUS) USB1.A9(VBUS) USB1.B4(VBUS) USB1.B9(VBUS)
VCC: C149.2 C160.1 C174.2 L9.1 L10.1 SW3.2 U15.1(IN) U15.3(EN) U22.5(VIN) U27.4(EN) U27.5(VIN)
ADC1_AIN0: C110.1 C111.1 R134.2 U30.6(AIN0)
ADC1_AIN1: C110.2 C111.2 R135.2 U30.7(AIN1)
ADC1_AIN2: C115.1 R224.1 R225.1 R226.2 U30.8(AIN2)
ADC1_AIN3: C127.1 R236.1 R237.1 R238.2 U30.9(AIN3)
ADC1_AIN4: C143.1 C144.1 R184.2 U30.10(AIN4)
ADC1_AIN5: C143.2 C144.2 R185.2 U30.11(AIN5)
ADC1_AIN6: C131.1 C132.1 R173.2 U30.12(AIN6)
ADC1_AIN7: C131.2 C132.2 R174.2 U30.13(AIN7)
ADC1_CS: U2.14(PB0) U30.20(CS)
ADC1_DRDY: U2.15(PB1) U30.21(DRDY)
ADC1_RST: R65.1 U30.15(RESET)
ADC1_SYNC: R66.1 U30.14(SYNCPDWN)
ADC2_AIN0: C21.1 C27.1 R19.2 U20.6(AIN0)
ADC2_AIN1: C21.2 C27.2 R20.2 U20.7(AIN1)
ADC2_AIN2: C44.1 R190.1 R191.1 R192.2 U20.8(AIN2)
ADC2_AIN3: C86.1 R212.1 R213.1 R214.2 U20.9(AIN3)
ADC2_AIN4: C60.1 C61.1 R63.2 U20.10(AIN4)
ADC2_AIN5: C60.2 C61.2 R87.2 U20.11(AIN5)
ADC2_AIN6: C139.1 C140.1 R180.2 U20.12(AIN6)
ADC2_AIN7: C139.2 C140.2 R181.2 U20.13(AIN7)
ADC2_CS: U2.19(PA9) U20.20(CS)
ADC2_DRDY: U2.18(PA8) U20.21(DRDY)
ADC2_RST: R59.1 U20.15(RESET)
ADC2_SYNC: R60.1 U20.14(SYNCPDWN)
ANT: U1.21(ANT) U29.1
CE1: C31.2 CN3.4 CN9.2 D5.2(C) U7.1(OUTA)
CE2: C62.2 CN4.4 CN10.2 D14.2(C) U6.1(OUTA)
CE3: C103.2 CN5.4 CN11.2 D16.2(C) U8.1(OUTA)
CE4: C112.2 CN6.4 CN12.2 D18.2(C) U16.1(OUTA)
CE5: C124.2 CN7.4 CN13.2 D20.2(C) U9.1(OUTA)
CE6: C133.2 CN8.4 CN14.2 D22.2(C) U41.1(OUTA)
CH582_BOOT: R24.1 SW4.1 U1.17(PB22/TMR3/RXD2)
CH582_UART1_RX: CN17.2 U1.6(PA8/RXD1/AIN12)
CH582_UART1_TX: CN17.3 U1.7(PA9/TMR0/TXD1/AIN13)
CH582_UART3_RX: CN18.2 U1.23(PA4/RXD3/AIN0) U2.29(PB6)
CH582_UART3_TX: CN18.3 U1.24(PA5/TXD3/AIN1) U2.30(PB7)
DAC_REF2V5: C19.2 R29.1 R241.1 R244.1 R247.1 R250.1 R253.1 U3.8(VREFIN/VREFOUT)
DAC_SYNC#: U2.10(PA4) U3.2(SYNC#)
DAC_VOUTA: R135.1 R139.1 R174.1 R178.1 R185.1 R186.1 U3.4(VOUTA)
DAC_VOUTB: R20.1 R30.1 R87.1 R93.1 R181.1 R182.1 U3.13(VOUTB)
DAC_VOUTC: U3.5(VOUTC) U41.12(+IND)
DAC_VOUTD: U3.12(VOUTD) U7.12(+IND)
DAC_VOUTE: U3.6(VOUTE) U9.12(+IND)
DAC_VOUTF: U3.11(VOUTF) U6.12(+IND)
DAC_VOUTG: U3.7(VOUTG) U16.12(+IND)
DAC_VOUTH: U3.10(VOUTH) U8.12(+IND)
PA1: LED5.1(-) U2.7(PA1)
POWEN: U2.25(PA15) U22.4(EN) U25.5(EN) U28.5(EN)
RE1: CN3.3 CN9.3 D6.1(C) U7.5(+INB)
RE2: CN4.3 CN10.3 D13.1(C) U6.5(+INB)
RE3: CN5.3 CN11.3 D15.1(C) U8.5(+INB)
RE4: CN6.3 CN12.3 D17.1(C) U16.5(+INB)
RE5: CN7.3 CN13.3 D19.1(C) U9.5(+INB)
RE6: CN8.3 CN14.3 D21.1(C) U41.5(+INB)
RESET: C47.2 SW1.2 U2.4(NRST)
SELECT_A0: U2.27(PB4) U4.1(A0)
SELECT_A1: U2.28(PB5) U4.16(A1)
SPI1MISO: U2.12(PA6) U20.22(DOUT) U30.22(DOUT)
SPI1MOSI: U2.13(PA7) U3.15(DIN) U20.23(DIN) U30.23(DIN)
SPI1SCK: U2.11(PA5) U3.16(SCLK) U20.24(SCLK) U30.24(SCLK)
SWCLK: CN16.2 U2.24(PA14)
SWDIO: CN16.3 U2.23(PA13)
TEMP: U2.8(PA2) U44.2
TIA_REF: R190.2 R212.2 R218.2 R224.2 R230.2 R236.2
TX_IN: C45.2 U2.2(PC14-OSC32_IN) X6.2
TX_OUT: C46.2 U2.3(PC15-OSC32_OUT) X6.1
USB_DM: D28.6 U2.21(PA11) USB1.A7(DN1) USB1.B7(DN2)
USB_DP: D28.1 U2.22(PA12) USB1.A6(DP1) USB1.B6(DP2)
VREF2.5V: C176.2 U20.4(VREFP) U30.4(VREFP) U31.6(VOUT)
WE1: C14.2 C15.2 C16.2 C28.2 CN3.2 CN9.4 D6.2(C) R16.1 R17.1 R18.1 R26.2 U7.9(-INC)
WE2: C96.2 CN4.2 CN10.4 D13.2(C) R94.1 U6.9(-INC)
WE3: C142.2 CN5.2 CN11.4 D15.2(C) R183.1 U8.9(-INC)
WE4: C117.2 CN6.2 CN12.4 D17.2(C) R140.1 U16.9(-INC)
WE5: C146.2 CN7.2 CN13.4 D19.2(C) R187.1 U9.9(-INC)
WE6: C138.2 CN8.2 CN14.4 D21.2(C) R179.1 U41.9(-INC)
X32MI: U1.19(X32MI) U42.3(OSC2)
X32MO: U1.18(X32MO) U42.1(OSC1)
$1N10456: R58.1 U2.31(PH3/BOOT0)
$1N12883: C1.2 C3.1 U1.3(VDCID) U1.4(VSW) U1.22(VDCIA)
$1N12884: C4.1 C5.1 U1.20(VINTA)
$1N12908: LED6.2(A) R64.1
$1N12924: LED6.1(K) U1.16(PB23/RST/TMR0_/TXD2_/PWM11)
$1N16652: LED5.2(+) R188.1
$1N30295: LED4.1(K) R189.1
$2N4592: R39.2 USB1.B5(CC2)
$2N4603: R40.2 USB1.A5(CC1)
$2N4616: LED2.2(A) LED3.2(A) R41.2
$2N4622: D23.1(K) Q1.2(S) SW3.1
$2N4637: R42.2 U12.2(PROG)
$2N4638: LED2.1(C) U12.7(CHRG#)
$2N4639: LED3.1(C) U12.6(STDBY#)
$2N12071: D24.2(A) L10.2 U27.1(SW)
$2N12073: C147.1 D24.1(K) L6.1 R61.1
$2N12074: R61.2 R62.1 U27.3(FB)
$2N12081: C153.2 R49.2 R50.1 U26.2(FB)
$2N12115: C148.1 L6.2 U26.5(EN) U26.8(IN)
$2N13249: C163.2 D26.2(A) L2.1
$2N13252: C159.2 D25.1(K) L4.1 R56.1
$2N13256: R56.2 R57.1 U22.3(FB)
$2N13257: C162.1 D25.2(A) L9.2 U22.1(SW)
$2N13262: C155.1 R9.1 R54.2 U25.2(FB)
$2N13271: C158.1 R5.1 R6.2 U28.2(FB)
$2N13321: C162.2 D26.1(K) D27.2(A)
$2N29433: C152.1 U26.6(NRSS)
$2N29711: C154.2 U15.4(BP/FB)
$2N29787: C156.2 U25.6(NRSS)
$2N29826: C157.2 U28.6(NRSS)
$5N5587: C18.2 L1.2 U3.3(AVDD)
$5N5643: C22.2 U20.19(XTAL1CLKIN) X5.1
$5N5644: C23.2 U20.18(XTAL2) X5.3
$5N6772: C72.2 U30.19(XTAL1CLKIN) X7.1
$5N6773: C73.2 U30.18(XTAL2) X7.3
$9N5267: C31.1 R2.1 R3.1 U7.2(-INA)
$9N5271: R3.2 R191.2 U7.6(-INB) U7.7(OUTB)
$9N5300: R27.1 R28.2 R29.2 U7.13(-IND)
$9N5311: C50.2 R30.2 U7.10(+INC)
$9N5321: C16.1 R18.2 U4.4(S1a) U4.13(S1b)
$9N5322: C15.1 R17.2 U4.5(S2a) U4.12(S2b)
$9N5323: C14.1 R16.2 U4.6(S3a) U4.11(S3b)
$9N5324: C28.1 R26.1 U4.7(S4a) U4.10(S4b)
$9N5325: R208.2 U4.8(Da)
$9N5326: R19.1 U4.9(Db)
$9N5378: R2.2 R27.2 U7.14(OUTD)
$9N5560: R239.1 R240.2 R241.2 U6.13(-IND)
$9N8977: C62.1 R53.1 R55.1 U6.2(-INA)
$9N8981: R55.2 R213.2 U6.6(-INB) U6.7(OUTB)
$9N9001: C89.2 R93.2 U6.10(+INC)
$9N9015: C96.1 R63.1 R94.2 U6.8(OUTC)
$9N29421: R53.2 R239.2 U6.14(OUTD)
$9N29793: R208.1 U7.8(OUTC)
$12N5267: C103.1 R100.1 R103.1 U8.2(-INA)
$12N5271: R103.2 R219.2 U8.6(-INB) U8.7(OUTB)
$12N5275: C106.1 R218.1 R219.1 R220.2
$12N5300: R242.1 R243.2 R244.2 U8.13(-IND)
$12N5378: R100.2 R242.2 U8.14(OUTD)
$12N5560: R245.1 R246.2 R247.2 U16.13(-IND)
$12N5567: R132.2 R245.2 U16.14(OUTD)
$12N8977: C112.1 R132.1 R133.1 U16.2(-INA)
$12N8981: R133.2 R225.2 U16.6(-INB) U16.7(OUTB)
$12N9001: C116.2 R139.2 U16.10(+INC)
$12N9015: C117.1 R134.1 R140.2 U16.8(OUTC)
$12N14958: C141.2 R182.2 U8.10(+INC)
$12N14959: C142.1 R180.1 R183.2 U8.8(OUTC)
$16N5267: C124.1 R141.1 R142.1 U9.2(-INA)
$16N5271: R142.2 R237.2 U9.6(-INB) U9.7(OUTB)
$16N5300: R248.1 R249.2 R250.2 U9.13(-IND)
$16N5378: R141.2 R248.2 U9.14(OUTD)
$16N5560: R251.1 R252.2 R253.2 U41.13(-IND)
$16N5567: R171.2 R251.2 U41.14(OUTD)
$16N8977: C133.1 R171.1 R172.1 U41.2(-INA)
$16N8981: R172.2 R231.2 U41.6(-INB) U41.7(OUTB)
$16N8986: C136.1 R230.1 R231.1 R232.2
$16N9001: C137.2 R178.2 U41.10(+INC)
$16N9015: C138.1 R173.1 R179.2 U41.8(OUTC)
$16N14958: C145.2 R186.2 U9.10(+INC)
$16N14959: C146.1 R184.1 R187.2 U9.8(OUTC)

Not connected (* = marked no-connect by the designer): D5 1(C)*; D14 1(C)*; D16 1(C)*; D18 1(C)*; D20 1(C)*; D22 1(C)*; D28 3* 4*; SW3 3*; U1 1(PA11/X32KO/TMR2)* 2(PA10/X32KI/TMR1)* 8(PB15/TCK/MISO_/DTR_)* 9(PB14/TIO/DSR_/MOSI_/PWM10)* 10(PB13/U2D+/SCK0_/SCL/TXD1_)* 11(PB12/U2D-/SCS_/SDA/RXD1_)* 12(PB11/UD+/TMR2_)* 13(PB10/UD-/TMR1_)* 14(PB7/TXD0/PWM9)* 15(PB4/RXD0/PWM7)* 25(PA15/MISO/RXD0_/AIN5)* 26(PA14/MOSI/TXD0_/AIN4)* 27(PA13/SCK0/PWM5/AIN3)* 28(PA12/SCS/PWM4/AIN2)*; U2 6(PA0/CK_IN)* 9(PA3)* 20(PA10)* 26(PB3)*; U20 25(D0CLKOUT)* 26(D1)* 27(D2)* 28(D3)*; U22 6(OC)*; U25 3(NC)* 7(DNC)*; U26 3(NC)* 7(DNC)*; U27 6(OC)*; U28 3(NC)* 7(DNC)*; U30 25(D0CLKOUT)* 26(D1)* 27(D2)* 28(D3)*; U31 1(DNC)* 3(TEMP)* 5(TRIM/NR)* 7(NC)* 8(DNC)*; U42 2(GND)* 4(GND)*; USB1 A8(SUB1)* B8(SUB2)*; X5 2(GND)* 4(GND)*; X7 2(GND)* 4(GND)*

## Notes on the sheets
sheet 1
- 直连VDCID
- BOOT
- 3225 10ppm 12pF
- 天线附近注意挖空
- 单端50欧，控制阻抗，3313叠层
sheet 2
- 0.6*(33+3.9)/3.9
  = 5.67V
- TPS7A4901：VOUT = 1.185 V × (R1 + R2) / R2
  其中R2为FB到地的电阻，不得大于242K
- R=1100/I
- 1.185*(180+15.4)/15.4 = 15.03V
- 0.6*(120+5)/5 = 15.8V
- Vo=–1.184*(1+R1/R2) R2为对地电阻
  Vo/(R1+R2)>5uA
sheet 3
- 若仅需要双通道可选同系列ADS1255
- 备用，不焊接
sheet 4
- Vbias = 8*VD - 8.5
- 恒电位仪
- [0V, 2.5V]
- 输出范围[-10V, 10V]
- VD = (vbias - 1.5 + 10)/8
- 开尔文接法
- 1.5V
- fc=1.2KHz
- 1.5V
- ADC钳位管最大10mA
- [0V, 2.5V]
- 恒电位仪
- 输出范围[-10V, 10V]
- VH = (vbias - 1.5 + 10)/8
- 开尔文接法
- 1.5V
- fc=1.2KHz
- 1.5V
- ADC钳位管最大10mA
- OCP模式允许输入范围[-10V,10V]
  OCP模式使用RE为输入
sheet 5
- 恒电位仪
- [0V, 2.5V]
- 输出范围[-10V, 10V]
- VH = (vbias - 1.5 + 10)/8
- 开尔文接法
- 1.5V
- fc=1.2KHz
- 1.5V
- ADC钳位管最大10mA
- [0V, 2.5V]
- 恒电位仪
- 输出范围[-10V, 10V]
- VH = (vbias - 1.5 + 10)/8
- 开尔文接法
- 1.5V
- fc=1.2KHz
- 1.5V
- ADC钳位管最大10mA
- OCP模式允许输入范围[-10V,10V]
  OCP模式使用RE为输入
sheet 6
- 恒电位仪
- [0V, 2.5V]
- 输出范围[-10V, 10V]
- VH = (vbias - 1.5 + 10)/8
- 开尔文接法
- 1.5V
- fc=1.2KHz
- 1.5V
- ADC钳位管最大10mA
- [0V, 2.5V]
- 恒电位仪
- 输出范围[-10V, 10V]
- VH = (vbias - 1.5 + 10)/8
- 开尔文接法
- 1.5V
- fc=1.2KHz
- 1.5V
- ADC钳位管最大10mA
- OCP模式允许输入范围[-10V,10V]
  OCP模式使用RE为输入
